# Altium project S6_FLHS_A2D-pcb-AW1.PrjPcb (part 2 of 3)

## Sheet ADC_DRIVER.SchDoc
size Tabloid; SheetNumber: 4; SheetTotal: 5
Used 40 times, as channels U1_ADC/U_ADC_DRIVER1, U1_ADC/U_ADC_DRIVER2, U1_ADC/U_ADC_DRIVER3, U1_ADC/U_ADC_DRIVER4, U1_ADC/U_ADC_DRIVER5, U1_ADC/U_ADC_DRIVER6, U1_ADC/U_ADC_DRIVER7, U1_ADC/U_ADC_DRIVER8, U2_ADC/U_ADC_DRIVER1, U2_ADC/U_ADC_DRIVER2, U2_ADC/U_ADC_DRIVER3, U2_ADC/U_ADC_DRIVER4, U2_ADC/U_ADC_DRIVER5, U2_ADC/U_ADC_DRIVER6, U2_ADC/U_ADC_DRIVER7, U2_ADC/U_ADC_DRIVER8, U3_ADC/U_ADC_DRIVER1, U3_ADC/U_ADC_DRIVER2, U3_ADC/U_ADC_DRIVER3, U3_ADC/U_ADC_DRIVER4, U3_ADC/U_ADC_DRIVER5, U3_ADC/U_ADC_DRIVER6, U3_ADC/U_ADC_DRIVER7, U3_ADC/U_ADC_DRIVER8, U4_ADC/U_ADC_DRIVER1, U4_ADC/U_ADC_DRIVER2, U4_ADC/U_ADC_DRIVER3, U4_ADC/U_ADC_DRIVER4, U4_ADC/U_ADC_DRIVER5, U4_ADC/U_ADC_DRIVER6, U4_ADC/U_ADC_DRIVER7, U4_ADC/U_ADC_DRIVER8, U5_ADC/U_ADC_DRIVER1, U5_ADC/U_ADC_DRIVER2, U5_ADC/U_ADC_DRIVER3, U5_ADC/U_ADC_DRIVER4, U5_ADC/U_ADC_DRIVER5, U5_ADC/U_ADC_DRIVER6, U5_ADC/U_ADC_DRIVER7, U5_ADC/U_ADC_DRIVER8. Parts and nets are listed once, with the designators drawn on the sheet.
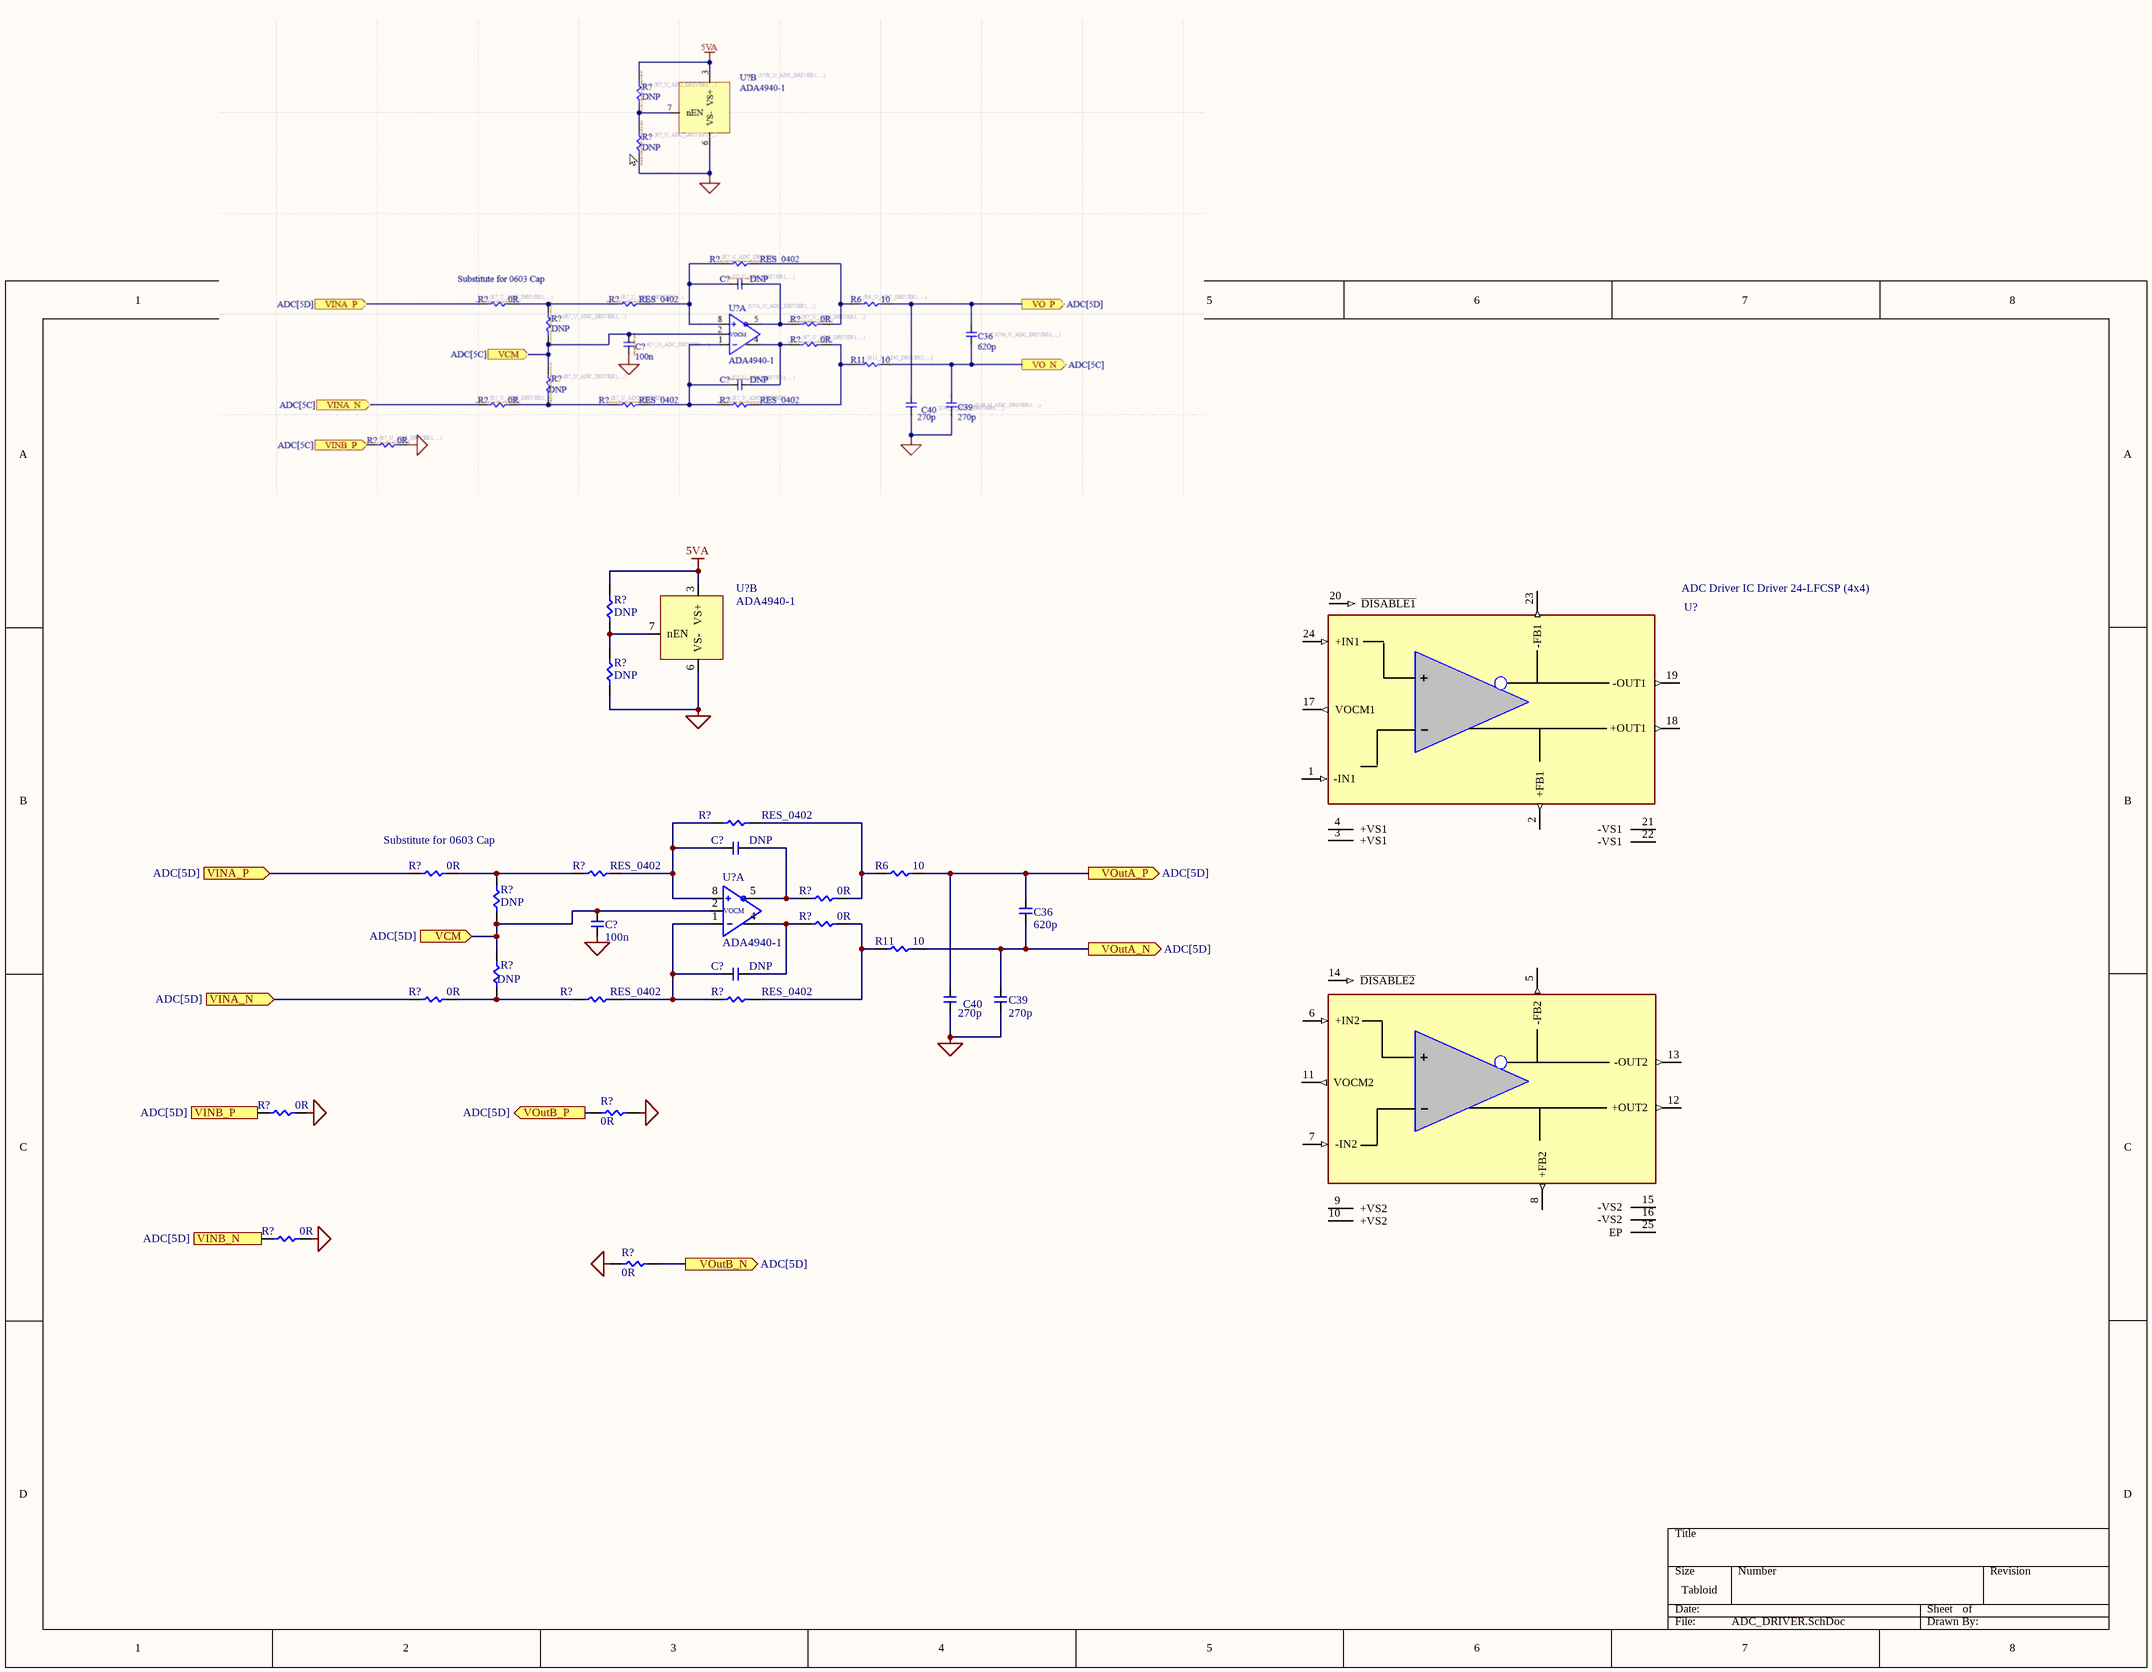
[diagram p2: ADC_DRIVER.SchDoc]

### Parts
(Parts that share a designator on the sheet are numbered #1, #2 ... from top to bottom, then left to right.)
C36  620p  [CAP_0402]
C39  270p  [CAP_0402]
C40  270p  [CAP_0402]
C?#1  DNP  [CAP_0603]  (net tie, no BOM)
C?#2  100n  [RES_0402]
C?#3  DNP  [CAP_0603]  (net tie, no BOM)
R6  10  [RES_0402]
R11  10  [RES_0402]
R?#1  DNP  [RES_0402]  (net tie, no BOM)
R?#2  DNP  [RES_0402]  (net tie, no BOM)
R?#3  RES_0402  [RES_0402]
R?#4  0R  [RES_0402]
R?#5  RES_0402  [RES_0402]
R?#6  DNP  [RES_0402]  (net tie, no BOM)
R?#7  0R  [RES_0402]
R?#8  0R  [RES_0402]
R?#9  DNP  [RES_0402]  (net tie, no BOM)
R?#10  0R  [RES_0402]
R?#11  RES_0402  [RES_0402]
R?#12  RES_0402  [RES_0402]
R?#13  0R  [RES_0402]
R?#14  0R  [RES_0402]
R?#15  0R  [RES_0402]
R?#16  0R  [RES_0402]
U?#1  ADA4940-1  [AD4940-1]  (part B of 2)
U?#2  ADC Driver IC Driver 24-LFCSP (4x4)  [QFN50P400X400X80-25N]
U?#3  ADA4940-1  [AD4940-1]  (part A of 2)

### Ports
VCM (in, see ADC[5D]), VINA_N (in, see ADC[5D]), VINA_P (in, see ADC[5D]), VINB_N (in, see ADC[5D]), VINB_P (in, see ADC[5D]), VOutA_N (out, see ADC[5D]), VOutA_P (out, see ADC[5D]), VOutB_N (out, see ADC[5D]), VOutB_P (out, see ADC[5D])

### Nets
5VA: R?#1.1 U?#1.3(VS+)
GND: C39.1 C40.1 C?#2.1 R?#2.0 R?#13.1 R?#14.1 R?#15.1 R?#16.1 U?#1.6(VS-)
VCM: C?#2.2 R?#6.0 R?#9.1 U?#3.2(VCOM) ; port VCM
VINA_N: R?#10.0 ; port VINA_N
VINA_P: R?#4.0 ; port VINA_P
VINB_N: R?#15.0 ; port VINB_N
VINB_P: R?#13.0 ; port VINB_P
VOutA_N: C36.1 C39.2 R11.1 ; port VOutA_N
VOutA_P: C36.2 C40.2 R6.1 ; port VOutA_P
VOutB_N: R?#16.0 ; port VOutB_N
VOutB_P: R?#14.0 ; port VOutB_P
NetC?#1_1: C?#1.1 R?#3.0 R?#5.1 U?#3.8(IN+)
NetC?#1_2: C?#1.2 R?#7.0 U?#3.5(OUT-)
NetC?#3_1: C?#3.1 R?#11.1 R?#12.0 U?#3.1(IN-)
NetC?#3_2: C?#3.2 R?#8.0 U?#3.4(OUT+)
NetR6_0: R6.0 R?#3.1 R?#7.1
NetR11_0: R11.0 R?#8.1 R?#12.1
NetR?#1_0: R?#1.0 R?#2.1 U?#1.7(nEN)
NetR?#4_1: R?#4.1 R?#5.0 R?#6.1
NetR?#9_0: R?#9.0 R?#10.1 R?#11.0

Not connected (* = marked no-connect by the designer): U?#2 1(-IN1) 2(+FB1) 3(+VS1) 4(+VS1) 5(-FB2) 6(+IN2) 7(-IN2) 8(+FB2) 9(+VS2) 10(+VS2) 11(VOCM2) 12(+OUT2) 13(-OUT2) 14(~{DISABLE2}) 15(-VS2) 16(-VS2) 17(VOCM1) 18(+OUT1) 19(-OUT1) 20(~{DISABLE1}) 21(-VS1) 22(-VS1) 23(-FB1) 24(+IN1) 25(EP)

### Channels
U1_ADC/U_ADC_DRIVER1: designators C36=C36_U1_ADC_U_ADC_DRIVER1 C39=C39_U1_ADC_U_ADC_DRIVER1 C40=C40_U1_ADC_U_ADC_DRIVER1 C?=C?_U1_ADC_U_ADC_DRIVER1#1 C?=C?_U1_ADC_U_ADC_DRIVER1#3 C?=C?_U1_ADC_U_ADC_DRIVER1#2 R6=R6_U1_ADC_U_ADC_DRIVER1 R11=R11_U1_ADC_U_ADC_DRIVER1 R?=R?_U1_ADC_U_ADC_DRIVER1#5 R?=R?_U1_ADC_U_ADC_DRIVER1#11 R?=R?_U1_ADC_U_ADC_DRIVER1#3 R?=R?_U1_ADC_U_ADC_DRIVER1#12 R?=R?_U1_ADC_U_ADC_DRIVER1#7 R?=R?_U1_ADC_U_ADC_DRIVER1#8 R?=R?_U1_ADC_U_ADC_DRIVER1#6 R?=R?_U1_ADC_U_ADC_DRIVER1#9 R?=R?_U1_ADC_U_ADC_DRIVER1#4 R?=R?_U1_ADC_U_ADC_DRIVER1#10 R?=R?_U1_ADC_U_ADC_DRIVER1#2 R?=R?_U1_ADC_U_ADC_DRIVER1#1 R?=R?_U1_ADC_U_ADC_DRIVER1#13 R?=R?_U1_ADC_U_ADC_DRIVER1#15 R?=R?_U1_ADC_U_ADC_DRIVER1#16 R?=R?_U1_ADC_U_ADC_DRIVER1#14 U?=U?_U1_ADC_U_ADC_DRIVER1#3 U?=U?_U1_ADC_U_ADC_DRIVER1#1 U?=U?_U1_ADC_U_ADC_DRIVER1#2; ports VCM=VCM_U1_ADC VINA_N=VINA_N1_U1_ADC VINA_P=VINA_P1_U1_ADC VINB_N=VINB_N1_U1_ADC VINB_P=VINB_P1_U1_ADC VOutA_N=VOutA_N1_U1_ADC VOutA_P=VOutA_P1_U1_ADC VOutB_N=VOutB_N1_U1_ADC VOutB_P=VOutB_P1_U1_ADC
U1_ADC/U_ADC_DRIVER2: designators C36=C36_U1_ADC_U_ADC_DRIVER2 C39=C39_U1_ADC_U_ADC_DRIVER2 C40=C40_U1_ADC_U_ADC_DRIVER2 C?=C?_U1_ADC_U_ADC_DRIVER2#1 C?=C?_U1_ADC_U_ADC_DRIVER2#3 C?=C?_U1_ADC_U_ADC_DRIVER2#2 R6=R6_U1_ADC_U_ADC_DRIVER2 R11=R11_U1_ADC_U_ADC_DRIVER2 R?=R?_U1_ADC_U_ADC_DRIVER2#5 R?=R?_U1_ADC_U_ADC_DRIVER2#11 R?=R?_U1_ADC_U_ADC_DRIVER2#3 R?=R?_U1_ADC_U_ADC_DRIVER2#12 R?=R?_U1_ADC_U_ADC_DRIVER2#7 R?=R?_U1_ADC_U_ADC_DRIVER2#8 R?=R?_U1_ADC_U_ADC_DRIVER2#6 R?=R?_U1_ADC_U_ADC_DRIVER2#9 R?=R?_U1_ADC_U_ADC_DRIVER2#4 R?=R?_U1_ADC_U_ADC_DRIVER2#10 R?=R?_U1_ADC_U_ADC_DRIVER2#2 R?=R?_U1_ADC_U_ADC_DRIVER2#1 R?=R?_U1_ADC_U_ADC_DRIVER2#13 R?=R?_U1_ADC_U_ADC_DRIVER2#15 R?=R?_U1_ADC_U_ADC_DRIVER2#16 R?=R?_U1_ADC_U_ADC_DRIVER2#14 U?=U?_U1_ADC_U_ADC_DRIVER2#3 U?=U?_U1_ADC_U_ADC_DRIVER2#1 U?=U?_U1_ADC_U_ADC_DRIVER2#2; ports VCM=VCM_U1_ADC VINA_N=VINA_N2_U1_ADC VINA_P=VINA_P2_U1_ADC VINB_N=VINB_N2_U1_ADC VINB_P=VINB_P2_U1_ADC VOutA_N=VOutA_N2_U1_ADC VOutA_P=VOutA_P2_U1_ADC VOutB_N=VOutB_N2_U1_ADC VOutB_P=VOutB_P2_U1_ADC
U1_ADC/U_ADC_DRIVER3: designators C36=C36_U1_ADC_U_ADC_DRIVER3 C39=C39_U1_ADC_U_ADC_DRIVER3 C40=C40_U1_ADC_U_ADC_DRIVER3 C?=C?_U1_ADC_U_ADC_DRIVER3#1 C?=C?_U1_ADC_U_ADC_DRIVER3#3 C?=C?_U1_ADC_U_ADC_DRIVER3#2 R6=R6_U1_ADC_U_ADC_DRIVER3 R11=R11_U1_ADC_U_ADC_DRIVER3 R?=R?_U1_ADC_U_ADC_DRIVER3#5 R?=R?_U1_ADC_U_ADC_DRIVER3#11 R?=R?_U1_ADC_U_ADC_DRIVER3#3 R?=R?_U1_ADC_U_ADC_DRIVER3#12 R?=R?_U1_ADC_U_ADC_DRIVER3#7 R?=R?_U1_ADC_U_ADC_DRIVER3#8 R?=R?_U1_ADC_U_ADC_DRIVER3#6 R?=R?_U1_ADC_U_ADC_DRIVER3#9 R?=R?_U1_ADC_U_ADC_DRIVER3#4 R?=R?_U1_ADC_U_ADC_DRIVER3#10 R?=R?_U1_ADC_U_ADC_DRIVER3#2 R?=R?_U1_ADC_U_ADC_DRIVER3#1 R?=R?_U1_ADC_U_ADC_DRIVER3#13 R?=R?_U1_ADC_U_ADC_DRIVER3#15 R?=R?_U1_ADC_U_ADC_DRIVER3#16 R?=R?_U1_ADC_U_ADC_DRIVER3#14 U?=U?_U1_ADC_U_ADC_DRIVER3#3 U?=U?_U1_ADC_U_ADC_DRIVER3#1 U?=U?_U1_ADC_U_ADC_DRIVER3#2; ports VCM=VCM_U1_ADC VINA_N=VINA_N3_U1_ADC VINA_P=VINA_P3_U1_ADC VINB_N=VINB_N3_U1_ADC VINB_P=VINB_P3_U1_ADC VOutA_N=VOutA_N3_U1_ADC VOutA_P=VOutA_P3_U1_ADC VOutB_N=VOutB_N3_U1_ADC VOutB_P=VOutB_P3_U1_ADC
U1_ADC/U_ADC_DRIVER4: designators C36=C36_U1_ADC_U_ADC_DRIVER4 C39=C39_U1_ADC_U_ADC_DRIVER4 C40=C40_U1_ADC_U_ADC_DRIVER4 C?=C?_U1_ADC_U_ADC_DRIVER4#1 C?=C?_U1_ADC_U_ADC_DRIVER4#3 C?=C?_U1_ADC_U_ADC_DRIVER4#2 R6=R6_U1_ADC_U_ADC_DRIVER4 R11=R11_U1_ADC_U_ADC_DRIVER4 R?=R?_U1_ADC_U_ADC_DRIVER4#5 R?=R?_U1_ADC_U_ADC_DRIVER4#11 R?=R?_U1_ADC_U_ADC_DRIVER4#3 R?=R?_U1_ADC_U_ADC_DRIVER4#12 R?=R?_U1_ADC_U_ADC_DRIVER4#7 R?=R?_U1_ADC_U_ADC_DRIVER4#8 R?=R?_U1_ADC_U_ADC_DRIVER4#6 R?=R?_U1_ADC_U_ADC_DRIVER4#9 R?=R?_U1_ADC_U_ADC_DRIVER4#4 R?=R?_U1_ADC_U_ADC_DRIVER4#10 R?=R?_U1_ADC_U_ADC_DRIVER4#2 R?=R?_U1_ADC_U_ADC_DRIVER4#1 R?=R?_U1_ADC_U_ADC_DRIVER4#13 R?=R?_U1_ADC_U_ADC_DRIVER4#15 R?=R?_U1_ADC_U_ADC_DRIVER4#16 R?=R?_U1_ADC_U_ADC_DRIVER4#14 U?=U?_U1_ADC_U_ADC_DRIVER4#3 U?=U?_U1_ADC_U_ADC_DRIVER4#1 U?=U?_U1_ADC_U_ADC_DRIVER4#2; ports VCM=VCM_U1_ADC VINA_N=VINA_N4_U1_ADC VINA_P=VINA_P4_U1_ADC VINB_N=VINB_N4_U1_ADC VINB_P=VINB_P4_U1_ADC VOutA_N=VOutA_N4_U1_ADC VOutA_P=VOutA_P4_U1_ADC VOutB_N=VOutB_N4_U1_ADC VOutB_P=VOutB_P4_U1_ADC
U1_ADC/U_ADC_DRIVER5: designators C36=C36_U1_ADC_U_ADC_DRIVER5 C39=C39_U1_ADC_U_ADC_DRIVER5 C40=C40_U1_ADC_U_ADC_DRIVER5 C?=C?_U1_ADC_U_ADC_DRIVER5#1 C?=C?_U1_ADC_U_ADC_DRIVER5#3 C?=C?_U1_ADC_U_ADC_DRIVER5#2 R6=R6_U1_ADC_U_ADC_DRIVER5 R11=R11_U1_ADC_U_ADC_DRIVER5 R?=R?_U1_ADC_U_ADC_DRIVER5#5 R?=R?_U1_ADC_U_ADC_DRIVER5#11 R?=R?_U1_ADC_U_ADC_DRIVER5#3 R?=R?_U1_ADC_U_ADC_DRIVER5#12 R?=R?_U1_ADC_U_ADC_DRIVER5#7 R?=R?_U1_ADC_U_ADC_DRIVER5#8 R?=R?_U1_ADC_U_ADC_DRIVER5#6 R?=R?_U1_ADC_U_ADC_DRIVER5#9 R?=R?_U1_ADC_U_ADC_DRIVER5#4 R?=R?_U1_ADC_U_ADC_DRIVER5#10 R?=R?_U1_ADC_U_ADC_DRIVER5#2 R?=R?_U1_ADC_U_ADC_DRIVER5#1 R?=R?_U1_ADC_U_ADC_DRIVER5#13 R?=R?_U1_ADC_U_ADC_DRIVER5#15 R?=R?_U1_ADC_U_ADC_DRIVER5#16 R?=R?_U1_ADC_U_ADC_DRIVER5#14 U?=U?_U1_ADC_U_ADC_DRIVER5#3 U?=U?_U1_ADC_U_ADC_DRIVER5#1 U?=U?_U1_ADC_U_ADC_DRIVER5#2; ports VCM=VCM_U1_ADC VINA_N=VINA_N5_U1_ADC VINA_P=VINA_P5_U1_ADC VINB_N=VINB_N5_U1_ADC VINB_P=VINB_P5_U1_ADC VOutA_N=VOutA_N5_U1_ADC VOutA_P=VOutA_P5_U1_ADC VOutB_N=VOutB_N5_U1_ADC VOutB_P=VOutB_P5_U1_ADC
U1_ADC/U_ADC_DRIVER6: designators C36=C36_U1_ADC_U_ADC_DRIVER6 C39=C39_U1_ADC_U_ADC_DRIVER6 C40=C40_U1_ADC_U_ADC_DRIVER6 C?=C?_U1_ADC_U_ADC_DRIVER6#1 C?=C?_U1_ADC_U_ADC_DRIVER6#3 C?=C?_U1_ADC_U_ADC_DRIVER6#2 R6=R6_U1_ADC_U_ADC_DRIVER6 R11=R11_U1_ADC_U_ADC_DRIVER6 R?=R?_U1_ADC_U_ADC_DRIVER6#5 R?=R?_U1_ADC_U_ADC_DRIVER6#11 R?=R?_U1_ADC_U_ADC_DRIVER6#3 R?=R?_U1_ADC_U_ADC_DRIVER6#12 R?=R?_U1_ADC_U_ADC_DRIVER6#7 R?=R?_U1_ADC_U_ADC_DRIVER6#8 R?=R?_U1_ADC_U_ADC_DRIVER6#6 R?=R?_U1_ADC_U_ADC_DRIVER6#9 R?=R?_U1_ADC_U_ADC_DRIVER6#4 R?=R?_U1_ADC_U_ADC_DRIVER6#10 R?=R?_U1_ADC_U_ADC_DRIVER6#2 R?=R?_U1_ADC_U_ADC_DRIVER6#1 R?=R?_U1_ADC_U_ADC_DRIVER6#13 R?=R?_U1_ADC_U_ADC_DRIVER6#15 R?=R?_U1_ADC_U_ADC_DRIVER6#16 R?=R?_U1_ADC_U_ADC_DRIVER6#14 U?=U?_U1_ADC_U_ADC_DRIVER6#3 U?=U?_U1_ADC_U_ADC_DRIVER6#1 U?=U?_U1_ADC_U_ADC_DRIVER6#2; ports VCM=VCM_U1_ADC VINA_N=VINA_N6_U1_ADC VINA_P=VINA_P6_U1_ADC VINB_N=VINB_N6_U1_ADC VINB_P=VINB_P6_U1_ADC VOutA_N=VOutA_N6_U1_ADC VOutA_P=VOutA_P6_U1_ADC VOutB_N=VOutB_N6_U1_ADC VOutB_P=VOutB_P6_U1_ADC
U1_ADC/U_ADC_DRIVER7: designators C36=C36_U1_ADC_U_ADC_DRIVER7 C39=C39_U1_ADC_U_ADC_DRIVER7 C40=C40_U1_ADC_U_ADC_DRIVER7 C?=C?_U1_ADC_U_ADC_DRIVER7#1 C?=C?_U1_ADC_U_ADC_DRIVER7#3 C?=C?_U1_ADC_U_ADC_DRIVER7#2 R6=R6_U1_ADC_U_ADC_DRIVER7 R11=R11_U1_ADC_U_ADC_DRIVER7 R?=R?_U1_ADC_U_ADC_DRIVER7#5 R?=R?_U1_ADC_U_ADC_DRIVER7#11 R?=R?_U1_ADC_U_ADC_DRIVER7#3 R?=R?_U1_ADC_U_ADC_DRIVER7#12 R?=R?_U1_ADC_U_ADC_DRIVER7#7 R?=R?_U1_ADC_U_ADC_DRIVER7#8 R?=R?_U1_ADC_U_ADC_DRIVER7#6 R?=R?_U1_ADC_U_ADC_DRIVER7#9 R?=R?_U1_ADC_U_ADC_DRIVER7#4 R?=R?_U1_ADC_U_ADC_DRIVER7#10 R?=R?_U1_ADC_U_ADC_DRIVER7#2 R?=R?_U1_ADC_U_ADC_DRIVER7#1 R?=R?_U1_ADC_U_ADC_DRIVER7#13 R?=R?_U1_ADC_U_ADC_DRIVER7#15 R?=R?_U1_ADC_U_ADC_DRIVER7#16 R?=R?_U1_ADC_U_ADC_DRIVER7#14 U?=U?_U1_ADC_U_ADC_DRIVER7#3 U?=U?_U1_ADC_U_ADC_DRIVER7#1 U?=U?_U1_ADC_U_ADC_DRIVER7#2; ports VCM=VCM_U1_ADC VINA_N=VINA_N7_U1_ADC VINA_P=VINA_P7_U1_ADC VINB_N=VINB_N7_U1_ADC VINB_P=VINB_P7_U1_ADC VOutA_N=VOutA_N7_U1_ADC VOutA_P=VOutA_P7_U1_ADC VOutB_N=VOutB_N7_U1_ADC VOutB_P=VOutB_P7_U1_ADC
U1_ADC/U_ADC_DRIVER8: designators C36=C36_U1_ADC_U_ADC_DRIVER8 C39=C39_U1_ADC_U_ADC_DRIVER8 C40=C40_U1_ADC_U_ADC_DRIVER8 C?=C?_U1_ADC_U_ADC_DRIVER8#1 C?=C?_U1_ADC_U_ADC_DRIVER8#3 C?=C?_U1_ADC_U_ADC_DRIVER8#2 R6=R6_U1_ADC_U_ADC_DRIVER8 R11=R11_U1_ADC_U_ADC_DRIVER8 R?=R?_U1_ADC_U_ADC_DRIVER8#5 R?=R?_U1_ADC_U_ADC_DRIVER8#11 R?=R?_U1_ADC_U_ADC_DRIVER8#3 R?=R?_U1_ADC_U_ADC_DRIVER8#12 R?=R?_U1_ADC_U_ADC_DRIVER8#7 R?=R?_U1_ADC_U_ADC_DRIVER8#8 R?=R?_U1_ADC_U_ADC_DRIVER8#6 R?=R?_U1_ADC_U_ADC_DRIVER8#9 R?=R?_U1_ADC_U_ADC_DRIVER8#4 R?=R?_U1_ADC_U_ADC_DRIVER8#10 R?=R?_U1_ADC_U_ADC_DRIVER8#2 R?=R?_U1_ADC_U_ADC_DRIVER8#1 R?=R?_U1_ADC_U_ADC_DRIVER8#13 R?=R?_U1_ADC_U_ADC_DRIVER8#15 R?=R?_U1_ADC_U_ADC_DRIVER8#16 R?=R?_U1_ADC_U_ADC_DRIVER8#14 U?=U?_U1_ADC_U_ADC_DRIVER8#3 U?=U?_U1_ADC_U_ADC_DRIVER8#1 U?=U?_U1_ADC_U_ADC_DRIVER8#2; ports VCM=VCM_U1_ADC VINA_N=VINA_N8_U1_ADC VINA_P=VINA_P8_U1_ADC VINB_N=VINB_N8_U1_ADC VINB_P=VINB_P8_U1_ADC VOutA_N=VOutA_N8_U1_ADC VOutA_P=VOutA_P8_U1_ADC VOutB_N=VOutB_N8_U1_ADC VOutB_P=VOutB_P8_U1_ADC
U2_ADC/U_ADC_DRIVER1: designators C36=C36_U2_ADC_U_ADC_DRIVER1 C39=C39_U2_ADC_U_ADC_DRIVER1 C40=C40_U2_ADC_U_ADC_DRIVER1 C?=C?_U2_ADC_U_ADC_DRIVER1#1 C?=C?_U2_ADC_U_ADC_DRIVER1#3 C?=C?_U2_ADC_U_ADC_DRIVER1#2 R6=R6_U2_ADC_U_ADC_DRIVER1 R11=R11_U2_ADC_U_ADC_DRIVER1 R?=R?_U2_ADC_U_ADC_DRIVER1#5 R?=R?_U2_ADC_U_ADC_DRIVER1#11 R?=R?_U2_ADC_U_ADC_DRIVER1#3 R?=R?_U2_ADC_U_ADC_DRIVER1#12 R?=R?_U2_ADC_U_ADC_DRIVER1#7 R?=R?_U2_ADC_U_ADC_DRIVER1#8 R?=R?_U2_ADC_U_ADC_DRIVER1#6 R?=R?_U2_ADC_U_ADC_DRIVER1#9 R?=R?_U2_ADC_U_ADC_DRIVER1#4 R?=R?_U2_ADC_U_ADC_DRIVER1#10 R?=R?_U2_ADC_U_ADC_DRIVER1#2 R?=R?_U2_ADC_U_ADC_DRIVER1#1 R?=R?_U2_ADC_U_ADC_DRIVER1#13 R?=R?_U2_ADC_U_ADC_DRIVER1#15 R?=R?_U2_ADC_U_ADC_DRIVER1#16 R?=R?_U2_ADC_U_ADC_DRIVER1#14 U?=U?_U2_ADC_U_ADC_DRIVER1#3 U?=U?_U2_ADC_U_ADC_DRIVER1#1 U?=U?_U2_ADC_U_ADC_DRIVER1#2; ports VCM=VCM_U2_ADC VINA_N=VINA_N1_U2_ADC VINA_P=VINA_P1_U2_ADC VINB_N=VINB_N1_U2_ADC VINB_P=VINB_P1_U2_ADC VOutA_N=VOutA_N1_U2_ADC VOutA_P=VOutA_P1_U2_ADC VOutB_N=VOutB_N1_U2_ADC VOutB_P=VOutB_P1_U2_ADC
U2_ADC/U_ADC_DRIVER2: designators C36=C36_U2_ADC_U_ADC_DRIVER2 C39=C39_U2_ADC_U_ADC_DRIVER2 C40=C40_U2_ADC_U_ADC_DRIVER2 C?=C?_U2_ADC_U_ADC_DRIVER2#1 C?=C?_U2_ADC_U_ADC_DRIVER2#3 C?=C?_U2_ADC_U_ADC_DRIVER2#2 R6=R6_U2_ADC_U_ADC_DRIVER2 R11=R11_U2_ADC_U_ADC_DRIVER2 R?=R?_U2_ADC_U_ADC_DRIVER2#5 R?=R?_U2_ADC_U_ADC_DRIVER2#11 R?=R?_U2_ADC_U_ADC_DRIVER2#3 R?=R?_U2_ADC_U_ADC_DRIVER2#12 R?=R?_U2_ADC_U_ADC_DRIVER2#7 R?=R?_U2_ADC_U_ADC_DRIVER2#8 R?=R?_U2_ADC_U_ADC_DRIVER2#6 R?=R?_U2_ADC_U_ADC_DRIVER2#9 R?=R?_U2_ADC_U_ADC_DRIVER2#4 R?=R?_U2_ADC_U_ADC_DRIVER2#10 R?=R?_U2_ADC_U_ADC_DRIVER2#2 R?=R?_U2_ADC_U_ADC_DRIVER2#1 R?=R?_U2_ADC_U_ADC_DRIVER2#13 R?=R?_U2_ADC_U_ADC_DRIVER2#15 R?=R?_U2_ADC_U_ADC_DRIVER2#16 R?=R?_U2_ADC_U_ADC_DRIVER2#14 U?=U?_U2_ADC_U_ADC_DRIVER2#3 U?=U?_U2_ADC_U_ADC_DRIVER2#1 U?=U?_U2_ADC_U_ADC_DRIVER2#2; ports VCM=VCM_U2_ADC VINA_N=VINA_N2_U2_ADC VINA_P=VINA_P2_U2_ADC VINB_N=VINB_N2_U2_ADC VINB_P=VINB_P2_U2_ADC VOutA_N=VOutA_N2_U2_ADC VOutA_P=VOutA_P2_U2_ADC VOutB_N=VOutB_N2_U2_ADC VOutB_P=VOutB_P2_U2_ADC
U2_ADC/U_ADC_DRIVER3: designators C36=C36_U2_ADC_U_ADC_DRIVER3 C39=C39_U2_ADC_U_ADC_DRIVER3 C40=C40_U2_ADC_U_ADC_DRIVER3 C?=C?_U2_ADC_U_ADC_DRIVER3#1 C?=C?_U2_ADC_U_ADC_DRIVER3#3 C?=C?_U2_ADC_U_ADC_DRIVER3#2 R6=R6_U2_ADC_U_ADC_DRIVER3 R11=R11_U2_ADC_U_ADC_DRIVER3 R?=R?_U2_ADC_U_ADC_DRIVER3#5 R?=R?_U2_ADC_U_ADC_DRIVER3#11 R?=R?_U2_ADC_U_ADC_DRIVER3#3 R?=R?_U2_ADC_U_ADC_DRIVER3#12 R?=R?_U2_ADC_U_ADC_DRIVER3#7 R?=R?_U2_ADC_U_ADC_DRIVER3#8 R?=R?_U2_ADC_U_ADC_DRIVER3#6 R?=R?_U2_ADC_U_ADC_DRIVER3#9 R?=R?_U2_ADC_U_ADC_DRIVER3#4 R?=R?_U2_ADC_U_ADC_DRIVER3#10 R?=R?_U2_ADC_U_ADC_DRIVER3#2 R?=R?_U2_ADC_U_ADC_DRIVER3#1 R?=R?_U2_ADC_U_ADC_DRIVER3#13 R?=R?_U2_ADC_U_ADC_DRIVER3#15 R?=R?_U2_ADC_U_ADC_DRIVER3#16 R?=R?_U2_ADC_U_ADC_DRIVER3#14 U?=U?_U2_ADC_U_ADC_DRIVER3#3 U?=U?_U2_ADC_U_ADC_DRIVER3#1 U?=U?_U2_ADC_U_ADC_DRIVER3#2; ports VCM=VCM_U2_ADC VINA_N=VINA_N3_U2_ADC VINA_P=VINA_P3_U2_ADC VINB_N=VINB_N3_U2_ADC VINB_P=VINB_P3_U2_ADC VOutA_N=VOutA_N3_U2_ADC VOutA_P=VOutA_P3_U2_ADC VOutB_N=VOutB_N3_U2_ADC VOutB_P=VOutB_P3_U2_ADC
U2_ADC/U_ADC_DRIVER4: designators C36=C36_U2_ADC_U_ADC_DRIVER4 C39=C39_U2_ADC_U_ADC_DRIVER4 C40=C40_U2_ADC_U_ADC_DRIVER4 C?=C?_U2_ADC_U_ADC_DRIVER4#1 C?=C?_U2_ADC_U_ADC_DRIVER4#3 C?=C?_U2_ADC_U_ADC_DRIVER4#2 R6=R6_U2_ADC_U_ADC_DRIVER4 R11=R11_U2_ADC_U_ADC_DRIVER4 R?=R?_U2_ADC_U_ADC_DRIVER4#5 R?=R?_U2_ADC_U_ADC_DRIVER4#11 R?=R?_U2_ADC_U_ADC_DRIVER4#3 R?=R?_U2_ADC_U_ADC_DRIVER4#12 R?=R?_U2_ADC_U_ADC_DRIVER4#7 R?=R?_U2_ADC_U_ADC_DRIVER4#8 R?=R?_U2_ADC_U_ADC_DRIVER4#6 R?=R?_U2_ADC_U_ADC_DRIVER4#9 R?=R?_U2_ADC_U_ADC_DRIVER4#4 R?=R?_U2_ADC_U_ADC_DRIVER4#10 R?=R?_U2_ADC_U_ADC_DRIVER4#2 R?=R?_U2_ADC_U_ADC_DRIVER4#1 R?=R?_U2_ADC_U_ADC_DRIVER4#13 R?=R?_U2_ADC_U_ADC_DRIVER4#15 R?=R?_U2_ADC_U_ADC_DRIVER4#16 R?=R?_U2_ADC_U_ADC_DRIVER4#14 U?=U?_U2_ADC_U_ADC_DRIVER4#3 U?=U?_U2_ADC_U_ADC_DRIVER4#1 U?=U?_U2_ADC_U_ADC_DRIVER4#2; ports VCM=VCM_U2_ADC VINA_N=VINA_N4_U2_ADC VINA_P=VINA_P4_U2_ADC VINB_N=VINB_N4_U2_ADC VINB_P=VINB_P4_U2_ADC VOutA_N=VOutA_N4_U2_ADC VOutA_P=VOutA_P4_U2_ADC VOutB_N=VOutB_N4_U2_ADC VOutB_P=VOutB_P4_U2_ADC
U2_ADC/U_ADC_DRIVER5: designators C36=C36_U2_ADC_U_ADC_DRIVER5 C39=C39_U2_ADC_U_ADC_DRIVER5 C40=C40_U2_ADC_U_ADC_DRIVER5 C?=C?_U2_ADC_U_ADC_DRIVER5#1 C?=C?_U2_ADC_U_ADC_DRIVER5#3 C?=C?_U2_ADC_U_ADC_DRIVER5#2 R6=R6_U2_ADC_U_ADC_DRIVER5 R11=R11_U2_ADC_U_ADC_DRIVER5 R?=R?_U2_ADC_U_ADC_DRIVER5#5 R?=R?_U2_ADC_U_ADC_DRIVER5#11 R?=R?_U2_ADC_U_ADC_DRIVER5#3 R?=R?_U2_ADC_U_ADC_DRIVER5#12 R?=R?_U2_ADC_U_ADC_DRIVER5#7 R?=R?_U2_ADC_U_ADC_DRIVER5#8 R?=R?_U2_ADC_U_ADC_DRIVER5#6 R?=R?_U2_ADC_U_ADC_DRIVER5#9 R?=R?_U2_ADC_U_ADC_DRIVER5#4 R?=R?_U2_ADC_U_ADC_DRIVER5#10 R?=R?_U2_ADC_U_ADC_DRIVER5#2 R?=R?_U2_ADC_U_ADC_DRIVER5#1 R?=R?_U2_ADC_U_ADC_DRIVER5#13 R?=R?_U2_ADC_U_ADC_DRIVER5#15 R?=R?_U2_ADC_U_ADC_DRIVER5#16 R?=R?_U2_ADC_U_ADC_DRIVER5#14 U?=U?_U2_ADC_U_ADC_DRIVER5#3 U?=U?_U2_ADC_U_ADC_DRIVER5#1 U?=U?_U2_ADC_U_ADC_DRIVER5#2; ports VCM=VCM_U2_ADC VINA_N=VINA_N5_U2_ADC VINA_P=VINA_P5_U2_ADC VINB_N=VINB_N5_U2_ADC VINB_P=VINB_P5_U2_ADC VOutA_N=VOutA_N5_U2_ADC VOutA_P=VOutA_P5_U2_ADC VOutB_N=VOutB_N5_U2_ADC VOutB_P=VOutB_P5_U2_ADC
U2_ADC/U_ADC_DRIVER6: designators C36=C36_U2_ADC_U_ADC_DRIVER6 C39=C39_U2_ADC_U_ADC_DRIVER6 C40=C40_U2_ADC_U_ADC_DRIVER6 C?=C?_U2_ADC_U_ADC_DRIVER6#1 C?=C?_U2_ADC_U_ADC_DRIVER6#3 C?=C?_U2_ADC_U_ADC_DRIVER6#2 R6=R6_U2_ADC_U_ADC_DRIVER6 R11=R11_U2_ADC_U_ADC_DRIVER6 R?=R?_U2_ADC_U_ADC_DRIVER6#5 R?=R?_U2_ADC_U_ADC_DRIVER6#11 R?=R?_U2_ADC_U_ADC_DRIVER6#3 R?=R?_U2_ADC_U_ADC_DRIVER6#12 R?=R?_U2_ADC_U_ADC_DRIVER6#7 R?=R?_U2_ADC_U_ADC_DRIVER6#8 R?=R?_U2_ADC_U_ADC_DRIVER6#6 R?=R?_U2_ADC_U_ADC_DRIVER6#9 R?=R?_U2_ADC_U_ADC_DRIVER6#4 R?=R?_U2_ADC_U_ADC_DRIVER6#10 R?=R?_U2_ADC_U_ADC_DRIVER6#2 R?=R?_U2_ADC_U_ADC_DRIVER6#1 R?=R?_U2_ADC_U_ADC_DRIVER6#13 R?=R?_U2_ADC_U_ADC_DRIVER6#15 R?=R?_U2_ADC_U_ADC_DRIVER6#16 R?=R?_U2_ADC_U_ADC_DRIVER6#14 U?=U?_U2_ADC_U_ADC_DRIVER6#3 U?=U?_U2_ADC_U_ADC_DRIVER6#1 U?=U?_U2_ADC_U_ADC_DRIVER6#2; ports VCM=VCM_U2_ADC VINA_N=VINA_N6_U2_ADC VINA_P=VINA_P6_U2_ADC VINB_N=VINB_N6_U2_ADC VINB_P=VINB_P6_U2_ADC VOutA_N=VOutA_N6_U2_ADC VOutA_P=VOutA_P6_U2_ADC VOutB_N=VOutB_N6_U2_ADC VOutB_P=VOutB_P6_U2_ADC
U2_ADC/U_ADC_DRIVER7: designators C36=C36_U2_ADC_U_ADC_DRIVER7 C39=C39_U2_ADC_U_ADC_DRIVER7 C40=C40_U2_ADC_U_ADC_DRIVER7 C?=C?_U2_ADC_U_ADC_DRIVER7#1 C?=C?_U2_ADC_U_ADC_DRIVER7#3 C?=C?_U2_ADC_U_ADC_DRIVER7#2 R6=R6_U2_ADC_U_ADC_DRIVER7 R11=R11_U2_ADC_U_ADC_DRIVER7 R?=R?_U2_ADC_U_ADC_DRIVER7#5 R?=R?_U2_ADC_U_ADC_DRIVER7#11 R?=R?_U2_ADC_U_ADC_DRIVER7#3 R?=R?_U2_ADC_U_ADC_DRIVER7#12 R?=R?_U2_ADC_U_ADC_DRIVER7#7 R?=R?_U2_ADC_U_ADC_DRIVER7#8 R?=R?_U2_ADC_U_ADC_DRIVER7#6 R?=R?_U2_ADC_U_ADC_DRIVER7#9 R?=R?_U2_ADC_U_ADC_DRIVER7#4 R?=R?_U2_ADC_U_ADC_DRIVER7#10 R?=R?_U2_ADC_U_ADC_DRIVER7#2 R?=R?_U2_ADC_U_ADC_DRIVER7#1 R?=R?_U2_ADC_U_ADC_DRIVER7#13 R?=R?_U2_ADC_U_ADC_DRIVER7#15 R?=R?_U2_ADC_U_ADC_DRIVER7#16 R?=R?_U2_ADC_U_ADC_DRIVER7#14 U?=U?_U2_ADC_U_ADC_DRIVER7#3 U?=U?_U2_ADC_U_ADC_DRIVER7#1 U?=U?_U2_ADC_U_ADC_DRIVER7#2; ports VCM=VCM_U2_ADC VINA_N=VINA_N7_U2_ADC VINA_P=VINA_P7_U2_ADC VINB_N=VINB_N7_U2_ADC VINB_P=VINB_P7_U2_ADC VOutA_N=VOutA_N7_U2_ADC VOutA_P=VOutA_P7_U2_ADC VOutB_N=VOutB_N7_U2_ADC VOutB_P=VOutB_P7_U2_ADC
U2_ADC/U_ADC_DRIVER8: designators C36=C36_U2_ADC_U_ADC_DRIVER8 C39=C39_U2_ADC_U_ADC_DRIVER8 C40=C40_U2_ADC_U_ADC_DRIVER8 C?=C?_U2_ADC_U_ADC_DRIVER8#1 C?=C?_U2_ADC_U_ADC_DRIVER8#3 C?=C?_U2_ADC_U_ADC_DRIVER8#2 R6=R6_U2_ADC_U_ADC_DRIVER8 R11=R11_U2_ADC_U_ADC_DRIVER8 R?=R?_U2_ADC_U_ADC_DRIVER8#5 R?=R?_U2_ADC_U_ADC_DRIVER8#11 R?=R?_U2_ADC_U_ADC_DRIVER8#3 R?=R?_U2_ADC_U_ADC_DRIVER8#12 R?=R?_U2_ADC_U_ADC_DRIVER8#7 R?=R?_U2_ADC_U_ADC_DRIVER8#8 R?=R?_U2_ADC_U_ADC_DRIVER8#6 R?=R?_U2_ADC_U_ADC_DRIVER8#9 R?=R?_U2_ADC_U_ADC_DRIVER8#4 R?=R?_U2_ADC_U_ADC_DRIVER8#10 R?=R?_U2_ADC_U_ADC_DRIVER8#2 R?=R?_U2_ADC_U_ADC_DRIVER8#1 R?=R?_U2_ADC_U_ADC_DRIVER8#13 R?=R?_U2_ADC_U_ADC_DRIVER8#15 R?=R?_U2_ADC_U_ADC_DRIVER8#16 R?=R?_U2_ADC_U_ADC_DRIVER8#14 U?=U?_U2_ADC_U_ADC_DRIVER8#3 U?=U?_U2_ADC_U_ADC_DRIVER8#1 U?=U?_U2_ADC_U_ADC_DRIVER8#2; ports VCM=VCM_U2_ADC VINA_N=VINA_N8_U2_ADC VINA_P=VINA_P8_U2_ADC VINB_N=VINB_N8_U2_ADC VINB_P=VINB_P8_U2_ADC VOutA_N=VOutA_N8_U2_ADC VOutA_P=VOutA_P8_U2_ADC VOutB_N=VOutB_N8_U2_ADC VOutB_P=VOutB_P8_U2_ADC
U3_ADC/U_ADC_DRIVER1: designators C36=C36_U3_ADC_U_ADC_DRIVER1 C39=C39_U3_ADC_U_ADC_DRIVER1 C40=C40_U3_ADC_U_ADC_DRIVER1 C?=C?_U3_ADC_U_ADC_DRIVER1#1 C?=C?_U3_ADC_U_ADC_DRIVER1#3 C?=C?_U3_ADC_U_ADC_DRIVER1#2 R6=R6_U3_ADC_U_ADC_DRIVER1 R11=R11_U3_ADC_U_ADC_DRIVER1 R?=R?_U3_ADC_U_ADC_DRIVER1#5 R?=R?_U3_ADC_U_ADC_DRIVER1#11 R?=R?_U3_ADC_U_ADC_DRIVER1#3 R?=R?_U3_ADC_U_ADC_DRIVER1#12 R?=R?_U3_ADC_U_ADC_DRIVER1#7 R?=R?_U3_ADC_U_ADC_DRIVER1#8 R?=R?_U3_ADC_U_ADC_DRIVER1#6 R?=R?_U3_ADC_U_ADC_DRIVER1#9 R?=R?_U3_ADC_U_ADC_DRIVER1#4 R?=R?_U3_ADC_U_ADC_DRIVER1#10 R?=R?_U3_ADC_U_ADC_DRIVER1#2 R?=R?_U3_ADC_U_ADC_DRIVER1#1 R?=R?_U3_ADC_U_ADC_DRIVER1#13 R?=R?_U3_ADC_U_ADC_DRIVER1#15 R?=R?_U3_ADC_U_ADC_DRIVER1#16 R?=R?_U3_ADC_U_ADC_DRIVER1#14 U?=U?_U3_ADC_U_ADC_DRIVER1#3 U?=U?_U3_ADC_U_ADC_DRIVER1#1 U?=U?_U3_ADC_U_ADC_DRIVER1#2; ports VCM=VCM_U3_ADC VINA_N=VINA_N1_U3_ADC VINA_P=VINA_P1_U3_ADC VINB_N=VINB_N1_U3_ADC VINB_P=VINB_P1_U3_ADC VOutA_N=VOutA_N1_U3_ADC VOutA_P=VOutA_P1_U3_ADC VOutB_N=VOutB_N1_U3_ADC VOutB_P=VOutB_P1_U3_ADC
U3_ADC/U_ADC_DRIVER2: designators C36=C36_U3_ADC_U_ADC_DRIVER2 C39=C39_U3_ADC_U_ADC_DRIVER2 C40=C40_U3_ADC_U_ADC_DRIVER2 C?=C?_U3_ADC_U_ADC_DRIVER2#1 C?=C?_U3_ADC_U_ADC_DRIVER2#3 C?=C?_U3_ADC_U_ADC_DRIVER2#2 R6=R6_U3_ADC_U_ADC_DRIVER2 R11=R11_U3_ADC_U_ADC_DRIVER2 R?=R?_U3_ADC_U_ADC_DRIVER2#5 R?=R?_U3_ADC_U_ADC_DRIVER2#11 R?=R?_U3_ADC_U_ADC_DRIVER2#3 R?=R?_U3_ADC_U_ADC_DRIVER2#12 R?=R?_U3_ADC_U_ADC_DRIVER2#7 R?=R?_U3_ADC_U_ADC_DRIVER2#8 R?=R?_U3_ADC_U_ADC_DRIVER2#6 R?=R?_U3_ADC_U_ADC_DRIVER2#9 R?=R?_U3_ADC_U_ADC_DRIVER2#4 R?=R?_U3_ADC_U_ADC_DRIVER2#10 R?=R?_U3_ADC_U_ADC_DRIVER2#2 R?=R?_U3_ADC_U_ADC_DRIVER2#1 R?=R?_U3_ADC_U_ADC_DRIVER2#13 R?=R?_U3_ADC_U_ADC_DRIVER2#15 R?=R?_U3_ADC_U_ADC_DRIVER2#16 R?=R?_U3_ADC_U_ADC_DRIVER2#14 U?=U?_U3_ADC_U_ADC_DRIVER2#3 U?=U?_U3_ADC_U_ADC_DRIVER2#1 U?=U?_U3_ADC_U_ADC_DRIVER2#2; ports VCM=VCM_U3_ADC VINA_N=VINA_N2_U3_ADC VINA_P=VINA_P2_U3_ADC VINB_N=VINB_N2_U3_ADC VINB_P=VINB_P2_U3_ADC VOutA_N=VOutA_N2_U3_ADC VOutA_P=VOutA_P2_U3_ADC VOutB_N=VOutB_N2_U3_ADC VOutB_P=VOutB_P2_U3_ADC
U3_ADC/U_ADC_DRIVER3: designators C36=C36_U3_ADC_U_ADC_DRIVER3 C39=C39_U3_ADC_U_ADC_DRIVER3 C40=C40_U3_ADC_U_ADC_DRIVER3 C?=C?_U3_ADC_U_ADC_DRIVER3#1 C?=C?_U3_ADC_U_ADC_DRIVER3#3 C?=C?_U3_ADC_U_ADC_DRIVER3#2 R6=R6_U3_ADC_U_ADC_DRIVER3 R11=R11_U3_ADC_U_ADC_DRIVER3 R?=R?_U3_ADC_U_ADC_DRIVER3#5 R?=R?_U3_ADC_U_ADC_DRIVER3#11 R?=R?_U3_ADC_U_ADC_DRIVER3#3 R?=R?_U3_ADC_U_ADC_DRIVER3#12 R?=R?_U3_ADC_U_ADC_DRIVER3#7 R?=R?_U3_ADC_U_ADC_DRIVER3#8 R?=R?_U3_ADC_U_ADC_DRIVER3#6 R?=R?_U3_ADC_U_ADC_DRIVER3#9 R?=R?_U3_ADC_U_ADC_DRIVER3#4 R?=R?_U3_ADC_U_ADC_DRIVER3#10 R?=R?_U3_ADC_U_ADC_DRIVER3#2 R?=R?_U3_ADC_U_ADC_DRIVER3#1 R?=R?_U3_ADC_U_ADC_DRIVER3#13 R?=R?_U3_ADC_U_ADC_DRIVER3#15 R?=R?_U3_ADC_U_ADC_DRIVER3#16 R?=R?_U3_ADC_U_ADC_DRIVER3#14 U?=U?_U3_ADC_U_ADC_DRIVER3#3 U?=U?_U3_ADC_U_ADC_DRIVER3#1 U?=U?_U3_ADC_U_ADC_DRIVER3#2; ports VCM=VCM_U3_ADC VINA_N=VINA_N3_U3_ADC VINA_P=VINA_P3_U3_ADC VINB_N=VINB_N3_U3_ADC VINB_P=VINB_P3_U3_ADC VOutA_N=VOutA_N3_U3_ADC VOutA_P=VOutA_P3_U3_ADC VOutB_N=VOutB_N3_U3_ADC VOutB_P=VOutB_P3_U3_ADC
U3_ADC/U_ADC_DRIVER4: designators C36=C36_U3_ADC_U_ADC_DRIVER4 C39=C39_U3_ADC_U_ADC_DRIVER4 C40=C40_U3_ADC_U_ADC_DRIVER4 C?=C?_U3_ADC_U_ADC_DRIVER4#1 C?=C?_U3_ADC_U_ADC_DRIVER4#3 C?=C?_U3_ADC_U_ADC_DRIVER4#2 R6=R6_U3_ADC_U_ADC_DRIVER4 R11=R11_U3_ADC_U_ADC_DRIVER4 R?=R?_U3_ADC_U_ADC_DRIVER4#5 R?=R?_U3_ADC_U_ADC_DRIVER4#11 R?=R?_U3_ADC_U_ADC_DRIVER4#3 R?=R?_U3_ADC_U_ADC_DRIVER4#12 R?=R?_U3_ADC_U_ADC_DRIVER4#7 R?=R?_U3_ADC_U_ADC_DRIVER4#8 R?=R?_U3_ADC_U_ADC_DRIVER4#6 R?=R?_U3_ADC_U_ADC_DRIVER4#9 R?=R?_U3_ADC_U_ADC_DRIVER4#4 R?=R?_U3_ADC_U_ADC_DRIVER4#10 R?=R?_U3_ADC_U_ADC_DRIVER4#2 R?=R?_U3_ADC_U_ADC_DRIVER4#1 R?=R?_U3_ADC_U_ADC_DRIVER4#13 R?=R?_U3_ADC_U_ADC_DRIVER4#15 R?=R?_U3_ADC_U_ADC_DRIVER4#16 R?=R?_U3_ADC_U_ADC_DRIVER4#14 U?=U?_U3_ADC_U_ADC_DRIVER4#3 U?=U?_U3_ADC_U_ADC_DRIVER4#1 U?=U?_U3_ADC_U_ADC_DRIVER4#2; ports VCM=VCM_U3_ADC VINA_N=VINA_N4_U3_ADC VINA_P=VINA_P4_U3_ADC VINB_N=VINB_N4_U3_ADC VINB_P=VINB_P4_U3_ADC VOutA_N=VOutA_N4_U3_ADC VOutA_P=VOutA_P4_U3_ADC VOutB_N=VOutB_N4_U3_ADC VOutB_P=VOutB_P4_U3_ADC
U3_ADC/U_ADC_DRIVER5: designators C36=C36_U3_ADC_U_ADC_DRIVER5 C39=C39_U3_ADC_U_ADC_DRIVER5 C40=C40_U3_ADC_U_ADC_DRIVER5 C?=C?_U3_ADC_U_ADC_DRIVER5#1 C?=C?_U3_ADC_U_ADC_DRIVER5#3 C?=C?_U3_ADC_U_ADC_DRIVER5#2 R6=R6_U3_ADC_U_ADC_DRIVER5 R11=R11_U3_ADC_U_ADC_DRIVER5 R?=R?_U3_ADC_U_ADC_DRIVER5#5 R?=R?_U3_ADC_U_ADC_DRIVER5#11 R?=R?_U3_ADC_U_ADC_DRIVER5#3 R?=R?_U3_ADC_U_ADC_DRIVER5#12 R?=R?_U3_ADC_U_ADC_DRIVER5#7 R?=R?_U3_ADC_U_ADC_DRIVER5#8 R?=R?_U3_ADC_U_ADC_DRIVER5#6 R?=R?_U3_ADC_U_ADC_DRIVER5#9 R?=R?_U3_ADC_U_ADC_DRIVER5#4 R?=R?_U3_ADC_U_ADC_DRIVER5#10 R?=R?_U3_ADC_U_ADC_DRIVER5#2 R?=R?_U3_ADC_U_ADC_DRIVER5#1 R?=R?_U3_ADC_U_ADC_DRIVER5#13 R?=R?_U3_ADC_U_ADC_DRIVER5#15 R?=R?_U3_ADC_U_ADC_DRIVER5#16 R?=R?_U3_ADC_U_ADC_DRIVER5#14 U?=U?_U3_ADC_U_ADC_DRIVER5#3 U?=U?_U3_ADC_U_ADC_DRIVER5#1 U?=U?_U3_ADC_U_ADC_DRIVER5#2; ports VCM=VCM_U3_ADC VINA_N=VINA_N5_U3_ADC VINA_P=VINA_P5_U3_ADC VINB_N=VINB_N5_U3_ADC VINB_P=VINB_P5_U3_ADC VOutA_N=VOutA_N5_U3_ADC VOutA_P=VOutA_P5_U3_ADC VOutB_N=VOutB_N5_U3_ADC VOutB_P=VOutB_P5_U3_ADC
U3_ADC/U_ADC_DRIVER6: designators C36=C36_U3_ADC_U_ADC_DRIVER6 C39=C39_U3_ADC_U_ADC_DRIVER6 C40=C40_U3_ADC_U_ADC_DRIVER6 C?=C?_U3_ADC_U_ADC_DRIVER6#1 C?=C?_U3_ADC_U_ADC_DRIVER6#3 C?=C?_U3_ADC_U_ADC_DRIVER6#2 R6=R6_U3_ADC_U_ADC_DRIVER6 R11=R11_U3_ADC_U_ADC_DRIVER6 R?=R?_U3_ADC_U_ADC_DRIVER6#5 R?=R?_U3_ADC_U_ADC_DRIVER6#11 R?=R?_U3_ADC_U_ADC_DRIVER6#3 R?=R?_U3_ADC_U_ADC_DRIVER6#12 R?=R?_U3_ADC_U_ADC_DRIVER6#7 R?=R?_U3_ADC_U_ADC_DRIVER6#8 R?=R?_U3_ADC_U_ADC_DRIVER6#6 R?=R?_U3_ADC_U_ADC_DRIVER6#9 R?=R?_U3_ADC_U_ADC_DRIVER6#4 R?=R?_U3_ADC_U_ADC_DRIVER6#10 R?=R?_U3_ADC_U_ADC_DRIVER6#2 R?=R?_U3_ADC_U_ADC_DRIVER6#1 R?=R?_U3_ADC_U_ADC_DRIVER6#13 R?=R?_U3_ADC_U_ADC_DRIVER6#15 R?=R?_U3_ADC_U_ADC_DRIVER6#16 R?=R?_U3_ADC_U_ADC_DRIVER6#14 U?=U?_U3_ADC_U_ADC_DRIVER6#3 U?=U?_U3_ADC_U_ADC_DRIVER6#1 U?=U?_U3_ADC_U_ADC_DRIVER6#2; ports VCM=VCM_U3_ADC VINA_N=VINA_N6_U3_ADC VINA_P=VINA_P6_U3_ADC VINB_N=VINB_N6_U3_ADC VINB_P=VINB_P6_U3_ADC VOutA_N=VOutA_N6_U3_ADC VOutA_P=VOutA_P6_U3_ADC VOutB_N=VOutB_N6_U3_ADC VOutB_P=VOutB_P6_U3_ADC
U3_ADC/U_ADC_DRIVER7: designators C36=C36_U3_ADC_U_ADC_DRIVER7 C39=C39_U3_ADC_U_ADC_DRIVER7 C40=C40_U3_ADC_U_ADC_DRIVER7 C?=C?_U3_ADC_U_ADC_DRIVER7#1 C?=C?_U3_ADC_U_ADC_DRIVER7#3 C?=C?_U3_ADC_U_ADC_DRIVER7#2 R6=R6_U3_ADC_U_ADC_DRIVER7 R11=R11_U3_ADC_U_ADC_DRIVER7 R?=R?_U3_ADC_U_ADC_DRIVER7#5 R?=R?_U3_ADC_U_ADC_DRIVER7#11 R?=R?_U3_ADC_U_ADC_DRIVER7#3 R?=R?_U3_ADC_U_ADC_DRIVER7#12 R?=R?_U3_ADC_U_ADC_DRIVER7#7 R?=R?_U3_ADC_U_ADC_DRIVER7#8 R?=R?_U3_ADC_U_ADC_DRIVER7#6 R?=R?_U3_ADC_U_ADC_DRIVER7#9 R?=R?_U3_ADC_U_ADC_DRIVER7#4 R?=R?_U3_ADC_U_ADC_DRIVER7#10 R?=R?_U3_ADC_U_ADC_DRIVER7#2 R?=R?_U3_ADC_U_ADC_DRIVER7#1 R?=R?_U3_ADC_U_ADC_DRIVER7#13 R?=R?_U3_ADC_U_ADC_DRIVER7#15 R?=R?_U3_ADC_U_ADC_DRIVER7#16 R?=R?_U3_ADC_U_ADC_DRIVER7#14 U?=U?_U3_ADC_U_ADC_DRIVER7#3 U?=U?_U3_ADC_U_ADC_DRIVER7#1 U?=U?_U3_ADC_U_ADC_DRIVER7#2; ports VCM=VCM_U3_ADC VINA_N=VINA_N7_U3_ADC VINA_P=VINA_P7_U3_ADC VINB_N=VINB_N7_U3_ADC VINB_P=VINB_P7_U3_ADC VOutA_N=VOutA_N7_U3_ADC VOutA_P=VOutA_P7_U3_ADC VOutB_N=VOutB_N7_U3_ADC VOutB_P=VOutB_P7_U3_ADC
U3_ADC/U_ADC_DRIVER8: designators C36=C36_U3_ADC_U_ADC_DRIVER8 C39=C39_U3_ADC_U_ADC_DRIVER8 C40=C40_U3_ADC_U_ADC_DRIVER8 C?=C?_U3_ADC_U_ADC_DRIVER8#1 C?=C?_U3_ADC_U_ADC_DRIVER8#3 C?=C?_U3_ADC_U_ADC_DRIVER8#2 R6=R6_U3_ADC_U_ADC_DRIVER8 R11=R11_U3_ADC_U_ADC_DRIVER8 R?=R?_U3_ADC_U_ADC_DRIVER8#5 R?=R?_U3_ADC_U_ADC_DRIVER8#11 R?=R?_U3_ADC_U_ADC_DRIVER8#3 R?=R?_U3_ADC_U_ADC_DRIVER8#12 R?=R?_U3_ADC_U_ADC_DRIVER8#7 R?=R?_U3_ADC_U_ADC_DRIVER8#8 R?=R?_U3_ADC_U_ADC_DRIVER8#6 R?=R?_U3_ADC_U_ADC_DRIVER8#9 R?=R?_U3_ADC_U_ADC_DRIVER8#4 R?=R?_U3_ADC_U_ADC_DRIVER8#10 R?=R?_U3_ADC_U_ADC_DRIVER8#2 R?=R?_U3_ADC_U_ADC_DRIVER8#1 R?=R?_U3_ADC_U_ADC_DRIVER8#13 R?=R?_U3_ADC_U_ADC_DRIVER8#15 R?=R?_U3_ADC_U_ADC_DRIVER8#16 R?=R?_U3_ADC_U_ADC_DRIVER8#14 U?=U?_U3_ADC_U_ADC_DRIVER8#3 U?=U?_U3_ADC_U_ADC_DRIVER8#1 U?=U?_U3_ADC_U_ADC_DRIVER8#2; ports VCM=VCM_U3_ADC VINA_N=VINA_N8_U3_ADC VINA_P=VINA_P8_U3_ADC VINB_N=VINB_N8_U3_ADC VINB_P=VINB_P8_U3_ADC VOutA_N=VOutA_N8_U3_ADC VOutA_P=VOutA_P8_U3_ADC VOutB_N=VOutB_N8_U3_ADC VOutB_P=VOutB_P8_U3_ADC
U4_ADC/U_ADC_DRIVER1: designators C36=C36_U4_ADC_U_ADC_DRIVER1 C39=C39_U4_ADC_U_ADC_DRIVER1 C40=C40_U4_ADC_U_ADC_DRIVER1 C?=C?_U4_ADC_U_ADC_DRIVER1#1 C?=C?_U4_ADC_U_ADC_DRIVER1#3 C?=C?_U4_ADC_U_ADC_DRIVER1#2 R6=R6_U4_ADC_U_ADC_DRIVER1 R11=R11_U4_ADC_U_ADC_DRIVER1 R?=R?_U4_ADC_U_ADC_DRIVER1#5 R?=R?_U4_ADC_U_ADC_DRIVER1#11 R?=R?_U4_ADC_U_ADC_DRIVER1#3 R?=R?_U4_ADC_U_ADC_DRIVER1#12 R?=R?_U4_ADC_U_ADC_DRIVER1#7 R?=R?_U4_ADC_U_ADC_DRIVER1#8 R?=R?_U4_ADC_U_ADC_DRIVER1#6 R?=R?_U4_ADC_U_ADC_DRIVER1#9 R?=R?_U4_ADC_U_ADC_DRIVER1#4 R?=R?_U4_ADC_U_ADC_DRIVER1#10 R?=R?_U4_ADC_U_ADC_DRIVER1#2 R?=R?_U4_ADC_U_ADC_DRIVER1#1 R?=R?_U4_ADC_U_ADC_DRIVER1#13 R?=R?_U4_ADC_U_ADC_DRIVER1#15 R?=R?_U4_ADC_U_ADC_DRIVER1#16 R?=R?_U4_ADC_U_ADC_DRIVER1#14 U?=U?_U4_ADC_U_ADC_DRIVER1#3 U?=U?_U4_ADC_U_ADC_DRIVER1#1 U?=U?_U4_ADC_U_ADC_DRIVER1#2; ports VCM=VCM_U4_ADC VINA_N=VINA_N1_U4_ADC VINA_P=VINA_P1_U4_ADC VINB_N=VINB_N1_U4_ADC VINB_P=VINB_P1_U4_ADC VOutA_N=VOutA_N1_U4_ADC VOutA_P=VOutA_P1_U4_ADC VOutB_N=VOutB_N1_U4_ADC VOutB_P=VOutB_P1_U4_ADC
U4_ADC/U_ADC_DRIVER2: designators C36=C36_U4_ADC_U_ADC_DRIVER2 C39=C39_U4_ADC_U_ADC_DRIVER2 C40=C40_U4_ADC_U_ADC_DRIVER2 C?=C?_U4_ADC_U_ADC_DRIVER2#1 C?=C?_U4_ADC_U_ADC_DRIVER2#3 C?=C?_U4_ADC_U_ADC_DRIVER2#2 R6=R6_U4_ADC_U_ADC_DRIVER2 R11=R11_U4_ADC_U_ADC_DRIVER2 R?=R?_U4_ADC_U_ADC_DRIVER2#5 R?=R?_U4_ADC_U_ADC_DRIVER2#11 R?=R?_U4_ADC_U_ADC_DRIVER2#3 R?=R?_U4_ADC_U_ADC_DRIVER2#12 R?=R?_U4_ADC_U_ADC_DRIVER2#7 R?=R?_U4_ADC_U_ADC_DRIVER2#8 R?=R?_U4_ADC_U_ADC_DRIVER2#6 R?=R?_U4_ADC_U_ADC_DRIVER2#9 R?=R?_U4_ADC_U_ADC_DRIVER2#4 R?=R?_U4_ADC_U_ADC_DRIVER2#10 R?=R?_U4_ADC_U_ADC_DRIVER2#2 R?=R?_U4_ADC_U_ADC_DRIVER2#1 R?=R?_U4_ADC_U_ADC_DRIVER2#13 R?=R?_U4_ADC_U_ADC_DRIVER2#15 R?=R?_U4_ADC_U_ADC_DRIVER2#16 R?=R?_U4_ADC_U_ADC_DRIVER2#14 U?=U?_U4_ADC_U_ADC_DRIVER2#3 U?=U?_U4_ADC_U_ADC_DRIVER2#1 U?=U?_U4_ADC_U_ADC_DRIVER2#2; ports VCM=VCM_U4_ADC VINA_N=VINA_N2_U4_ADC VINA_P=VINA_P2_U4_ADC VINB_N=VINB_N2_U4_ADC VINB_P=VINB_P2_U4_ADC VOutA_N=VOutA_N2_U4_ADC VOutA_P=VOutA_P2_U4_ADC VOutB_N=VOutB_N2_U4_ADC VOutB_P=VOutB_P2_U4_ADC
U4_ADC/U_ADC_DRIVER3: designators C36=C36_U4_ADC_U_ADC_DRIVER3 C39=C39_U4_ADC_U_ADC_DRIVER3 C40=C40_U4_ADC_U_ADC_DRIVER3 C?=C?_U4_ADC_U_ADC_DRIVER3#1 C?=C?_U4_ADC_U_ADC_DRIVER3#3 C?=C?_U4_ADC_U_ADC_DRIVER3#2 R6=R6_U4_ADC_U_ADC_DRIVER3 R11=R11_U4_ADC_U_ADC_DRIVER3 R?=R?_U4_ADC_U_ADC_DRIVER3#5 R?=R?_U4_ADC_U_ADC_DRIVER3#11 R?=R?_U4_ADC_U_ADC_DRIVER3#3 R?=R?_U4_ADC_U_ADC_DRIVER3#12 R?=R?_U4_ADC_U_ADC_DRIVER3#7 R?=R?_U4_ADC_U_ADC_DRIVER3#8 R?=R?_U4_ADC_U_ADC_DRIVER3#6 R?=R?_U4_ADC_U_ADC_DRIVER3#9 R?=R?_U4_ADC_U_ADC_DRIVER3#4 R?=R?_U4_ADC_U_ADC_DRIVER3#10 R?=R?_U4_ADC_U_ADC_DRIVER3#2 R?=R?_U4_ADC_U_ADC_DRIVER3#1 R?=R?_U4_ADC_U_ADC_DRIVER3#13 R?=R?_U4_ADC_U_ADC_DRIVER3#15 R?=R?_U4_ADC_U_ADC_DRIVER3#16 R?=R?_U4_ADC_U_ADC_DRIVER3#14 U?=U?_U4_ADC_U_ADC_DRIVER3#3 U?=U?_U4_ADC_U_ADC_DRIVER3#1 U?=U?_U4_ADC_U_ADC_DRIVER3#2; ports VCM=VCM_U4_ADC VINA_N=VINA_N3_U4_ADC VINA_P=VINA_P3_U4_ADC VINB_N=VINB_N3_U4_ADC VINB_P=VINB_P3_U4_ADC VOutA_N=VOutA_N3_U4_ADC VOutA_P=VOutA_P3_U4_ADC VOutB_N=VOutB_N3_U4_ADC VOutB_P=VOutB_P3_U4_ADC
U4_ADC/U_ADC_DRIVER4: designators C36=C36_U4_ADC_U_ADC_DRIVER4 C39=C39_U4_ADC_U_ADC_DRIVER4 C40=C40_U4_ADC_U_ADC_DRIVER4 C?=C?_U4_ADC_U_ADC_DRIVER4#1 C?=C?_U4_ADC_U_ADC_DRIVER4#3 C?=C?_U4_ADC_U_ADC_DRIVER4#2 R6=R6_U4_ADC_U_ADC_DRIVER4 R11=R11_U4_ADC_U_ADC_DRIVER4 R?=R?_U4_ADC_U_ADC_DRIVER4#5 R?=R?_U4_ADC_U_ADC_DRIVER4#11 R?=R?_U4_ADC_U_ADC_DRIVER4#3 R?=R?_U4_ADC_U_ADC_DRIVER4#12 R?=R?_U4_ADC_U_ADC_DRIVER4#7 R?=R?_U4_ADC_U_ADC_DRIVER4#8 R?=R?_U4_ADC_U_ADC_DRIVER4#6 R?=R?_U4_ADC_U_ADC_DRIVER4#9 R?=R?_U4_ADC_U_ADC_DRIVER4#4 R?=R?_U4_ADC_U_ADC_DRIVER4#10 R?=R?_U4_ADC_U_ADC_DRIVER4#2 R?=R?_U4_ADC_U_ADC_DRIVER4#1 R?=R?_U4_ADC_U_ADC_DRIVER4#13 R?=R?_U4_ADC_U_ADC_DRIVER4#15 R?=R?_U4_ADC_U_ADC_DRIVER4#16 R?=R?_U4_ADC_U_ADC_DRIVER4#14 U?=U?_U4_ADC_U_ADC_DRIVER4#3 U?=U?_U4_ADC_U_ADC_DRIVER4#1 U?=U?_U4_ADC_U_ADC_DRIVER4#2; ports VCM=VCM_U4_ADC VINA_N=VINA_N4_U4_ADC VINA_P=VINA_P4_U4_ADC VINB_N=VINB_N4_U4_ADC VINB_P=VINB_P4_U4_ADC VOutA_N=VOutA_N4_U4_ADC VOutA_P=VOutA_P4_U4_ADC VOutB_N=VOutB_N4_U4_ADC VOutB_P=VOutB_P4_U4_ADC
U4_ADC/U_ADC_DRIVER5: designators C36=C36_U4_ADC_U_ADC_DRIVER5 C39=C39_U4_ADC_U_ADC_DRIVER5 C40=C40_U4_ADC_U_ADC_DRIVER5 C?=C?_U4_ADC_U_ADC_DRIVER5#1 C?=C?_U4_ADC_U_ADC_DRIVER5#3 C?=C?_U4_ADC_U_ADC_DRIVER5#2 R6=R6_U4_ADC_U_ADC_DRIVER5 R11=R11_U4_ADC_U_ADC_DRIVER5 R?=R?_U4_ADC_U_ADC_DRIVER5#5 R?=R?_U4_ADC_U_ADC_DRIVER5#11 R?=R?_U4_ADC_U_ADC_DRIVER5#3 R?=R?_U4_ADC_U_ADC_DRIVER5#12 R?=R?_U4_ADC_U_ADC_DRIVER5#7 R?=R?_U4_ADC_U_ADC_DRIVER5#8 R?=R?_U4_ADC_U_ADC_DRIVER5#6 R?=R?_U4_ADC_U_ADC_DRIVER5#9 R?=R?_U4_ADC_U_ADC_DRIVER5#4 R?=R?_U4_ADC_U_ADC_DRIVER5#10 R?=R?_U4_ADC_U_ADC_DRIVER5#2 R?=R?_U4_ADC_U_ADC_DRIVER5#1 R?=R?_U4_ADC_U_ADC_DRIVER5#13 R?=R?_U4_ADC_U_ADC_DRIVER5#15 R?=R?_U4_ADC_U_ADC_DRIVER5#16 R?=R?_U4_ADC_U_ADC_DRIVER5#14 U?=U?_U4_ADC_U_ADC_DRIVER5#3 U?=U?_U4_ADC_U_ADC_DRIVER5#1 U?=U?_U4_ADC_U_ADC_DRIVER5#2; ports VCM=VCM_U4_ADC VINA_N=VINA_N5_U4_ADC VINA_P=VINA_P5_U4_ADC VINB_N=VINB_N5_U4_ADC VINB_P=VINB_P5_U4_ADC VOutA_N=VOutA_N5_U4_ADC VOutA_P=VOutA_P5_U4_ADC VOutB_N=VOutB_N5_U4_ADC VOutB_P=VOutB_P5_U4_ADC
U4_ADC/U_ADC_DRIVER6: designators C36=C36_U4_ADC_U_ADC_DRIVER6 C39=C39_U4_ADC_U_ADC_DRIVER6 C40=C40_U4_ADC_U_ADC_DRIVER6 C?=C?_U4_ADC_U_ADC_DRIVER6#1 C?=C?_U4_ADC_U_ADC_DRIVER6#3 C?=C?_U4_ADC_U_ADC_DRIVER6#2 R6=R6_U4_ADC_U_ADC_DRIVER6 R11=R11_U4_ADC_U_ADC_DRIVER6 R?=R?_U4_ADC_U_ADC_DRIVER6#5 R?=R?_U4_ADC_U_ADC_DRIVER6#11 R?=R?_U4_ADC_U_ADC_DRIVER6#3 R?=R?_U4_ADC_U_ADC_DRIVER6#12 R?=R?_U4_ADC_U_ADC_DRIVER6#7 R?=R?_U4_ADC_U_ADC_DRIVER6#8 R?=R?_U4_ADC_U_ADC_DRIVER6#6 R?=R?_U4_ADC_U_ADC_DRIVER6#9 R?=R?_U4_ADC_U_ADC_DRIVER6#4 R?=R?_U4_ADC_U_ADC_DRIVER6#10 R?=R?_U4_ADC_U_ADC_DRIVER6#2 R?=R?_U4_ADC_U_ADC_DRIVER6#1 R?=R?_U4_ADC_U_ADC_DRIVER6#13 R?=R?_U4_ADC_U_ADC_DRIVER6#15 R?=R?_U4_ADC_U_ADC_DRIVER6#16 R?=R?_U4_ADC_U_ADC_DRIVER6#14 U?=U?_U4_ADC_U_ADC_DRIVER6#3 U?=U?_U4_ADC_U_ADC_DRIVER6#1 U?=U?_U4_ADC_U_ADC_DRIVER6#2; ports VCM=VCM_U4_ADC VINA_N=VINA_N6_U4_ADC VINA_P=VINA_P6_U4_ADC VINB_N=VINB_N6_U4_ADC VINB_P=VINB_P6_U4_ADC VOutA_N=VOutA_N6_U4_ADC VOutA_P=VOutA_P6_U4_ADC VOutB_N=VOutB_N6_U4_ADC VOutB_P=VOutB_P6_U4_ADC
U4_ADC/U_ADC_DRIVER7: designators C36=C36_U4_ADC_U_ADC_DRIVER7 C39=C39_U4_ADC_U_ADC_DRIVER7 C40=C40_U4_ADC_U_ADC_DRIVER7 C?=C?_U4_ADC_U_ADC_DRIVER7#1 C?=C?_U4_ADC_U_ADC_DRIVER7#3 C?=C?_U4_ADC_U_ADC_DRIVER7#2 R6=R6_U4_ADC_U_ADC_DRIVER7 R11=R11_U4_ADC_U_ADC_DRIVER7 R?=R?_U4_ADC_U_ADC_DRIVER7#5 R?=R?_U4_ADC_U_ADC_DRIVER7#11 R?=R?_U4_ADC_U_ADC_DRIVER7#3 R?=R?_U4_ADC_U_ADC_DRIVER7#12 R?=R?_U4_ADC_U_ADC_DRIVER7#7 R?=R?_U4_ADC_U_ADC_DRIVER7#8 R?=R?_U4_ADC_U_ADC_DRIVER7#6 R?=R?_U4_ADC_U_ADC_DRIVER7#9 R?=R?_U4_ADC_U_ADC_DRIVER7#4 R?=R?_U4_ADC_U_ADC_DRIVER7#10 R?=R?_U4_ADC_U_ADC_DRIVER7#2 R?=R?_U4_ADC_U_ADC_DRIVER7#1 R?=R?_U4_ADC_U_ADC_DRIVER7#13 R?=R?_U4_ADC_U_ADC_DRIVER7#15 R?=R?_U4_ADC_U_ADC_DRIVER7#16 R?=R?_U4_ADC_U_ADC_DRIVER7#14 U?=U?_U4_ADC_U_ADC_DRIVER7#3 U?=U?_U4_ADC_U_ADC_DRIVER7#1 U?=U?_U4_ADC_U_ADC_DRIVER7#2; ports VCM=VCM_U4_ADC VINA_N=VINA_N7_U4_ADC VINA_P=VINA_P7_U4_ADC VINB_N=VINB_N7_U4_ADC VINB_P=VINB_P7_U4_ADC VOutA_N=VOutA_N7_U4_ADC VOutA_P=VOutA_P7_U4_ADC VOutB_N=VOutB_N7_U4_ADC VOutB_P=VOutB_P7_U4_ADC
U4_ADC/U_ADC_DRIVER8: designators C36=C36_U4_ADC_U_ADC_DRIVER8 C39=C39_U4_ADC_U_ADC_DRIVER8 C40=C40_U4_ADC_U_ADC_DRIVER8 C?=C?_U4_ADC_U_ADC_DRIVER8#1 C?=C?_U4_ADC_U_ADC_DRIVER8#3 C?=C?_U4_ADC_U_ADC_DRIVER8#2 R6=R6_U4_ADC_U_ADC_DRIVER8 R11=R11_U4_ADC_U_ADC_DRIVER8 R?=R?_U4_ADC_U_ADC_DRIVER8#5 R?=R?_U4_ADC_U_ADC_DRIVER8#11 R?=R?_U4_ADC_U_ADC_DRIVER8#3 R?=R?_U4_ADC_U_ADC_DRIVER8#12 R?=R?_U4_ADC_U_ADC_DRIVER8#7 R?=R?_U4_ADC_U_ADC_DRIVER8#8 R?=R?_U4_ADC_U_ADC_DRIVER8#6 R?=R?_U4_ADC_U_ADC_DRIVER8#9 R?=R?_U4_ADC_U_ADC_DRIVER8#4 R?=R?_U4_ADC_U_ADC_DRIVER8#10 R?=R?_U4_ADC_U_ADC_DRIVER8#2 R?=R?_U4_ADC_U_ADC_DRIVER8#1 R?=R?_U4_ADC_U_ADC_DRIVER8#13 R?=R?_U4_ADC_U_ADC_DRIVER8#15 R?=R?_U4_ADC_U_ADC_DRIVER8#16 R?=R?_U4_ADC_U_ADC_DRIVER8#14 U?=U?_U4_ADC_U_ADC_DRIVER8#3 U?=U?_U4_ADC_U_ADC_DRIVER8#1 U?=U?_U4_ADC_U_ADC_DRIVER8#2; ports VCM=VCM_U4_ADC VINA_N=VINA_N8_U4_ADC VINA_P=VINA_P8_U4_ADC VINB_N=VINB_N8_U4_ADC VINB_P=VINB_P8_U4_ADC VOutA_N=VOutA_N8_U4_ADC VOutA_P=VOutA_P8_U4_ADC VOutB_N=VOutB_N8_U4_ADC VOutB_P=VOutB_P8_U4_ADC
U5_ADC/U_ADC_DRIVER1: designators C36=C36_U5_ADC_U_ADC_DRIVER1 C39=C39_U5_ADC_U_ADC_DRIVER1 C40=C40_U5_ADC_U_ADC_DRIVER1 C?=C?_U5_ADC_U_ADC_DRIVER1#1 C?=C?_U5_ADC_U_ADC_DRIVER1#3 C?=C?_U5_ADC_U_ADC_DRIVER1#2 R6=R6_U5_ADC_U_ADC_DRIVER1 R11=R11_U5_ADC_U_ADC_DRIVER1 R?=R?_U5_ADC_U_ADC_DRIVER1#5 R?=R?_U5_ADC_U_ADC_DRIVER1#11 R?=R?_U5_ADC_U_ADC_DRIVER1#3 R?=R?_U5_ADC_U_ADC_DRIVER1#12 R?=R?_U5_ADC_U_ADC_DRIVER1#7 R?=R?_U5_ADC_U_ADC_DRIVER1#8 R?=R?_U5_ADC_U_ADC_DRIVER1#6 R?=R?_U5_ADC_U_ADC_DRIVER1#9 R?=R?_U5_ADC_U_ADC_DRIVER1#4 R?=R?_U5_ADC_U_ADC_DRIVER1#10 R?=R?_U5_ADC_U_ADC_DRIVER1#2 R?=R?_U5_ADC_U_ADC_DRIVER1#1 R?=R?_U5_ADC_U_ADC_DRIVER1#13 R?=R?_U5_ADC_U_ADC_DRIVER1#15 R?=R?_U5_ADC_U_ADC_DRIVER1#16 R?=R?_U5_ADC_U_ADC_DRIVER1#14 U?=U?_U5_ADC_U_ADC_DRIVER1#3 U?=U?_U5_ADC_U_ADC_DRIVER1#1 U?=U?_U5_ADC_U_ADC_DRIVER1#2; ports VCM=VCM_U5_ADC VINA_N=VINA_N1_U5_ADC VINA_P=VINA_P1_U5_ADC VINB_N=VINB_N1_U5_ADC VINB_P=VINB_P1_U5_ADC VOutA_N=VOutA_N1_U5_ADC VOutA_P=VOutA_P1_U5_ADC VOutB_N=VOutB_N1_U5_ADC VOutB_P=VOutB_P1_U5_ADC
U5_ADC/U_ADC_DRIVER2: designators C36=C36_U5_ADC_U_ADC_DRIVER2 C39=C39_U5_ADC_U_ADC_DRIVER2 C40=C40_U5_ADC_U_ADC_DRIVER2 C?=C?_U5_ADC_U_ADC_DRIVER2#1 C?=C?_U5_ADC_U_ADC_DRIVER2#3 C?=C?_U5_ADC_U_ADC_DRIVER2#2 R6=R6_U5_ADC_U_ADC_DRIVER2 R11=R11_U5_ADC_U_ADC_DRIVER2 R?=R?_U5_ADC_U_ADC_DRIVER2#5 R?=R?_U5_ADC_U_ADC_DRIVER2#11 R?=R?_U5_ADC_U_ADC_DRIVER2#3 R?=R?_U5_ADC_U_ADC_DRIVER2#12 R?=R?_U5_ADC_U_ADC_DRIVER2#7 R?=R?_U5_ADC_U_ADC_DRIVER2#8 R?=R?_U5_ADC_U_ADC_DRIVER2#6 R?=R?_U5_ADC_U_ADC_DRIVER2#9 R?=R?_U5_ADC_U_ADC_DRIVER2#4 R?=R?_U5_ADC_U_ADC_DRIVER2#10 R?=R?_U5_ADC_U_ADC_DRIVER2#2 R?=R?_U5_ADC_U_ADC_DRIVER2#1 R?=R?_U5_ADC_U_ADC_DRIVER2#13 R?=R?_U5_ADC_U_ADC_DRIVER2#15 R?=R?_U5_ADC_U_ADC_DRIVER2#16 R?=R?_U5_ADC_U_ADC_DRIVER2#14 U?=U?_U5_ADC_U_ADC_DRIVER2#3 U?=U?_U5_ADC_U_ADC_DRIVER2#1 U?=U?_U5_ADC_U_ADC_DRIVER2#2; ports VCM=VCM_U5_ADC VINA_N=VINA_N2_U5_ADC VINA_P=VINA_P2_U5_ADC VINB_N=VINB_N2_U5_ADC VINB_P=VINB_P2_U5_ADC VOutA_N=VOutA_N2_U5_ADC VOutA_P=VOutA_P2_U5_ADC VOutB_N=VOutB_N2_U5_ADC VOutB_P=VOutB_P2_U5_ADC
U5_ADC/U_ADC_DRIVER3: designators C36=C36_U5_ADC_U_ADC_DRIVER3 C39=C39_U5_ADC_U_ADC_DRIVER3 C40=C40_U5_ADC_U_ADC_DRIVER3 C?=C?_U5_ADC_U_ADC_DRIVER3#1 C?=C?_U5_ADC_U_ADC_DRIVER3#3 C?=C?_U5_ADC_U_ADC_DRIVER3#2 R6=R6_U5_ADC_U_ADC_DRIVER3 R11=R11_U5_ADC_U_ADC_DRIVER3 R?=R?_U5_ADC_U_ADC_DRIVER3#5 R?=R?_U5_ADC_U_ADC_DRIVER3#11 R?=R?_U5_ADC_U_ADC_DRIVER3#3 R?=R?_U5_ADC_U_ADC_DRIVER3#12 R?=R?_U5_ADC_U_ADC_DRIVER3#7 R?=R?_U5_ADC_U_ADC_DRIVER3#8 R?=R?_U5_ADC_U_ADC_DRIVER3#6 R?=R?_U5_ADC_U_ADC_DRIVER3#9 R?=R?_U5_ADC_U_ADC_DRIVER3#4 R?=R?_U5_ADC_U_ADC_DRIVER3#10 R?=R?_U5_ADC_U_ADC_DRIVER3#2 R?=R?_U5_ADC_U_ADC_DRIVER3#1 R?=R?_U5_ADC_U_ADC_DRIVER3#13 R?=R?_U5_ADC_U_ADC_DRIVER3#15 R?=R?_U5_ADC_U_ADC_DRIVER3#16 R?=R?_U5_ADC_U_ADC_DRIVER3#14 U?=U?_U5_ADC_U_ADC_DRIVER3#3 U?=U?_U5_ADC_U_ADC_DRIVER3#1 U?=U?_U5_ADC_U_ADC_DRIVER3#2; ports VCM=VCM_U5_ADC VINA_N=VINA_N3_U5_ADC VINA_P=VINA_P3_U5_ADC VINB_N=VINB_N3_U5_ADC VINB_P=VINB_P3_U5_ADC VOutA_N=VOutA_N3_U5_ADC VOutA_P=VOutA_P3_U5_ADC VOutB_N=VOutB_N3_U5_ADC VOutB_P=VOutB_P3_U5_ADC
U5_ADC/U_ADC_DRIVER4: designators C36=C36_U5_ADC_U_ADC_DRIVER4 C39=C39_U5_ADC_U_ADC_DRIVER4 C40=C40_U5_ADC_U_ADC_DRIVER4 C?=C?_U5_ADC_U_ADC_DRIVER4#1 C?=C?_U5_ADC_U_ADC_DRIVER4#3 C?=C?_U5_ADC_U_ADC_DRIVER4#2 R6=R6_U5_ADC_U_ADC_DRIVER4 R11=R11_U5_ADC_U_ADC_DRIVER4 R?=R?_U5_ADC_U_ADC_DRIVER4#5 R?=R?_U5_ADC_U_ADC_DRIVER4#11 R?=R?_U5_ADC_U_ADC_DRIVER4#3 R?=R?_U5_ADC_U_ADC_DRIVER4#12 R?=R?_U5_ADC_U_ADC_DRIVER4#7 R?=R?_U5_ADC_U_ADC_DRIVER4#8 R?=R?_U5_ADC_U_ADC_DRIVER4#6 R?=R?_U5_ADC_U_ADC_DRIVER4#9 R?=R?_U5_ADC_U_ADC_DRIVER4#4 R?=R?_U5_ADC_U_ADC_DRIVER4#10 R?=R?_U5_ADC_U_ADC_DRIVER4#2 R?=R?_U5_ADC_U_ADC_DRIVER4#1 R?=R?_U5_ADC_U_ADC_DRIVER4#13 R?=R?_U5_ADC_U_ADC_DRIVER4#15 R?=R?_U5_ADC_U_ADC_DRIVER4#16 R?=R?_U5_ADC_U_ADC_DRIVER4#14 U?=U?_U5_ADC_U_ADC_DRIVER4#3 U?=U?_U5_ADC_U_ADC_DRIVER4#1 U?=U?_U5_ADC_U_ADC_DRIVER4#2; ports VCM=VCM_U5_ADC VINA_N=VINA_N4_U5_ADC VINA_P=VINA_P4_U5_ADC VINB_N=VINB_N4_U5_ADC VINB_P=VINB_P4_U5_ADC VOutA_N=VOutA_N4_U5_ADC VOutA_P=VOutA_P4_U5_ADC VOutB_N=VOutB_N4_U5_ADC VOutB_P=VOutB_P4_U5_ADC
U5_ADC/U_ADC_DRIVER5: designators C36=C36_U5_ADC_U_ADC_DRIVER5 C39=C39_U5_ADC_U_ADC_DRIVER5 C40=C40_U5_ADC_U_ADC_DRIVER5 C?=C?_U5_ADC_U_ADC_DRIVER5#1 C?=C?_U5_ADC_U_ADC_DRIVER5#3 C?=C?_U5_ADC_U_ADC_DRIVER5#2 R6=R6_U5_ADC_U_ADC_DRIVER5 R11=R11_U5_ADC_U_ADC_DRIVER5 R?=R?_U5_ADC_U_ADC_DRIVER5#5 R?=R?_U5_ADC_U_ADC_DRIVER5#11 R?=R?_U5_ADC_U_ADC_DRIVER5#3 R?=R?_U5_ADC_U_ADC_DRIVER5#12 R?=R?_U5_ADC_U_ADC_DRIVER5#7 R?=R?_U5_ADC_U_ADC_DRIVER5#8 R?=R?_U5_ADC_U_ADC_DRIVER5#6 R?=R?_U5_ADC_U_ADC_DRIVER5#9 R?=R?_U5_ADC_U_ADC_DRIVER5#4 R?=R?_U5_ADC_U_ADC_DRIVER5#10 R?=R?_U5_ADC_U_ADC_DRIVER5#2 R?=R?_U5_ADC_U_ADC_DRIVER5#1 R?=R?_U5_ADC_U_ADC_DRIVER5#13 R?=R?_U5_ADC_U_ADC_DRIVER5#15 R?=R?_U5_ADC_U_ADC_DRIVER5#16 R?=R?_U5_ADC_U_ADC_DRIVER5#14 U?=U?_U5_ADC_U_ADC_DRIVER5#3 U?=U?_U5_ADC_U_ADC_DRIVER5#1 U?=U?_U5_ADC_U_ADC_DRIVER5#2; ports VCM=VCM_U5_ADC VINA_N=VINA_N5_U5_ADC VINA_P=VINA_P5_U5_ADC VINB_N=VINB_N5_U5_ADC VINB_P=VINB_P5_U5_ADC VOutA_N=VOutA_N5_U5_ADC VOutA_P=VOutA_P5_U5_ADC VOutB_N=VOutB_N5_U5_ADC VOutB_P=VOutB_P5_U5_ADC
U5_ADC/U_ADC_DRIVER6: designators C36=C36_U5_ADC_U_ADC_DRIVER6 C39=C39_U5_ADC_U_ADC_DRIVER6 C40=C40_U5_ADC_U_ADC_DRIVER6 C?=C?_U5_ADC_U_ADC_DRIVER6#1 C?=C?_U5_ADC_U_ADC_DRIVER6#3 C?=C?_U5_ADC_U_ADC_DRIVER6#2 R6=R6_U5_ADC_U_ADC_DRIVER6 R11=R11_U5_ADC_U_ADC_DRIVER6 R?=R?_U5_ADC_U_ADC_DRIVER6#5 R?=R?_U5_ADC_U_ADC_DRIVER6#11 R?=R?_U5_ADC_U_ADC_DRIVER6#3 R?=R?_U5_ADC_U_ADC_DRIVER6#12 R?=R?_U5_ADC_U_ADC_DRIVER6#7 R?=R?_U5_ADC_U_ADC_DRIVER6#8 R?=R?_U5_ADC_U_ADC_DRIVER6#6 R?=R?_U5_ADC_U_ADC_DRIVER6#9 R?=R?_U5_ADC_U_ADC_DRIVER6#4 R?=R?_U5_ADC_U_ADC_DRIVER6#10 R?=R?_U5_ADC_U_ADC_DRIVER6#2 R?=R?_U5_ADC_U_ADC_DRIVER6#1 R?=R?_U5_ADC_U_ADC_DRIVER6#13 R?=R?_U5_ADC_U_ADC_DRIVER6#15 R?=R?_U5_ADC_U_ADC_DRIVER6#16 R?=R?_U5_ADC_U_ADC_DRIVER6#14 U?=U?_U5_ADC_U_ADC_DRIVER6#3 U?=U?_U5_ADC_U_ADC_DRIVER6#1 U?=U?_U5_ADC_U_ADC_DRIVER6#2; ports VCM=VCM_U5_ADC VINA_N=VINA_N6_U5_ADC VINA_P=VINA_P6_U5_ADC VINB_N=VINB_N6_U5_ADC VINB_P=VINB_P6_U5_ADC VOutA_N=VOutA_N6_U5_ADC VOutA_P=VOutA_P6_U5_ADC VOutB_N=VOutB_N6_U5_ADC VOutB_P=VOutB_P6_U5_ADC
U5_ADC/U_ADC_DRIVER7: designators C36=C36_U5_ADC_U_ADC_DRIVER7 C39=C39_U5_ADC_U_ADC_DRIVER7 C40=C40_U5_ADC_U_ADC_DRIVER7 C?=C?_U5_ADC_U_ADC_DRIVER7#1 C?=C?_U5_ADC_U_ADC_DRIVER7#3 C?=C?_U5_ADC_U_ADC_DRIVER7#2 R6=R6_U5_ADC_U_ADC_DRIVER7 R11=R11_U5_ADC_U_ADC_DRIVER7 R?=R?_U5_ADC_U_ADC_DRIVER7#5 R?=R?_U5_ADC_U_ADC_DRIVER7#11 R?=R?_U5_ADC_U_ADC_DRIVER7#3 R?=R?_U5_ADC_U_ADC_DRIVER7#12 R?=R?_U5_ADC_U_ADC_DRIVER7#7 R?=R?_U5_ADC_U_ADC_DRIVER7#8 R?=R?_U5_ADC_U_ADC_DRIVER7#6 R?=R?_U5_ADC_U_ADC_DRIVER7#9 R?=R?_U5_ADC_U_ADC_DRIVER7#4 R?=R?_U5_ADC_U_ADC_DRIVER7#10 R?=R?_U5_ADC_U_ADC_DRIVER7#2 R?=R?_U5_ADC_U_ADC_DRIVER7#1 R?=R?_U5_ADC_U_ADC_DRIVER7#13 R?=R?_U5_ADC_U_ADC_DRIVER7#15 R?=R?_U5_ADC_U_ADC_DRIVER7#16 R?=R?_U5_ADC_U_ADC_DRIVER7#14 U?=U?_U5_ADC_U_ADC_DRIVER7#3 U?=U?_U5_ADC_U_ADC_DRIVER7#1 U?=U?_U5_ADC_U_ADC_DRIVER7#2; ports VCM=VCM_U5_ADC VINA_N=VINA_N7_U5_ADC VINA_P=VINA_P7_U5_ADC VINB_N=VINB_N7_U5_ADC VINB_P=VINB_P7_U5_ADC VOutA_N=VOutA_N7_U5_ADC VOutA_P=VOutA_P7_U5_ADC VOutB_N=VOutB_N7_U5_ADC VOutB_P=VOutB_P7_U5_ADC
U5_ADC/U_ADC_DRIVER8: designators C36=C36_U5_ADC_U_ADC_DRIVER8 C39=C39_U5_ADC_U_ADC_DRIVER8 C40=C40_U5_ADC_U_ADC_DRIVER8 C?=C?_U5_ADC_U_ADC_DRIVER8#1 C?=C?_U5_ADC_U_ADC_DRIVER8#3 C?=C?_U5_ADC_U_ADC_DRIVER8#2 R6=R6_U5_ADC_U_ADC_DRIVER8 R11=R11_U5_ADC_U_ADC_DRIVER8 R?=R?_U5_ADC_U_ADC_DRIVER8#5 R?=R?_U5_ADC_U_ADC_DRIVER8#11 R?=R?_U5_ADC_U_ADC_DRIVER8#3 R?=R?_U5_ADC_U_ADC_DRIVER8#12 R?=R?_U5_ADC_U_ADC_DRIVER8#7 R?=R?_U5_ADC_U_ADC_DRIVER8#8 R?=R?_U5_ADC_U_ADC_DRIVER8#6 R?=R?_U5_ADC_U_ADC_DRIVER8#9 R?=R?_U5_ADC_U_ADC_DRIVER8#4 R?=R?_U5_ADC_U_ADC_DRIVER8#10 R?=R?_U5_ADC_U_ADC_DRIVER8#2 R?=R?_U5_ADC_U_ADC_DRIVER8#1 R?=R?_U5_ADC_U_ADC_DRIVER8#13 R?=R?_U5_ADC_U_ADC_DRIVER8#15 R?=R?_U5_ADC_U_ADC_DRIVER8#16 R?=R?_U5_ADC_U_ADC_DRIVER8#14 U?=U?_U5_ADC_U_ADC_DRIVER8#3 U?=U?_U5_ADC_U_ADC_DRIVER8#1 U?=U?_U5_ADC_U_ADC_DRIVER8#2; ports VCM=VCM_U5_ADC VINA_N=VINA_N8_U5_ADC VINA_P=VINA_P8_U5_ADC VINB_N=VINB_N8_U5_ADC VINB_P=VINB_P8_U5_ADC VOutA_N=VOutA_N8_U5_ADC VOutA_P=VOutA_P8_U5_ADC VOutB_N=VOutB_N8_U5_ADC VOutB_P=VOutB_P8_U5_ADC

### Notes on the sheet
- (near R?#4) Substitute for 0603 Cap
- (in symbol ADA4940-1, part A) VOCM

### Library data of the parts
C36 C39 C40 = 0.1u: CAP CER 0.1uF 6V X7R 0402 10%
C?#1 C?#3 = CAP_0603: CAP SMD 0603; Tolerance: *; Voltage Rating: *; Manufacturer: *; Part Number: *
C?#2 = CAP_0402: CAP SMD 0402; Tolerance: *; Voltage Rating: *; Manufacturer: *; Part Number: *
R6 R11 R?#1-R?#16 = RES_0402: RES SMD 0402; Manufacturer: *; Part Number: *; Power Rating: *
U?#1 U?#3 = ADA4940-1: Low Power, Low Distortion Fully Differential ADC Driver, GBW 260 MHz, 7V
U?#2 = ADA4940-2ACPZ-R7: IC OPAMP DIFF 2 CIRCUIT 24LFCSP; Manufacturer: Analog Devices; Vendor: Digikey; Vendor PN: 505-ADA4940-2ACPZ-R7TR-ND; SnapEDA_Link: https://www.snapeda.com/parts/ADA4940-2ACPZ-R7/Analog+Devices/view-part/?ref=snap; Package: LFCSP -24 Analog Devices; Value: *; Manufacturer PN: ADA4940-2ACPZ-R7; Check_prices: https://www.snapeda.com/parts/ADA4940-2ACPZ-R7/Analog+Devices/view-part/?ref=eda